# EAGLE design PM_Controller_v1p05 (EAGLE 9.6.2)
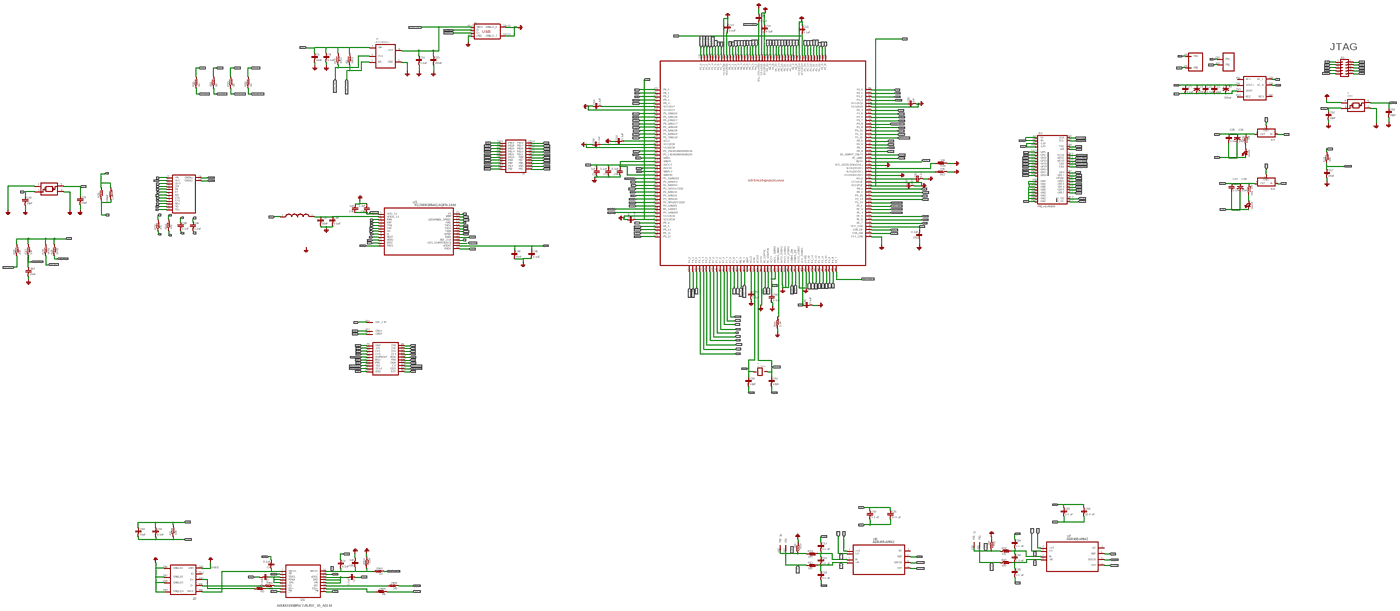
[diagram p0: schematic, sheet 1, overview]
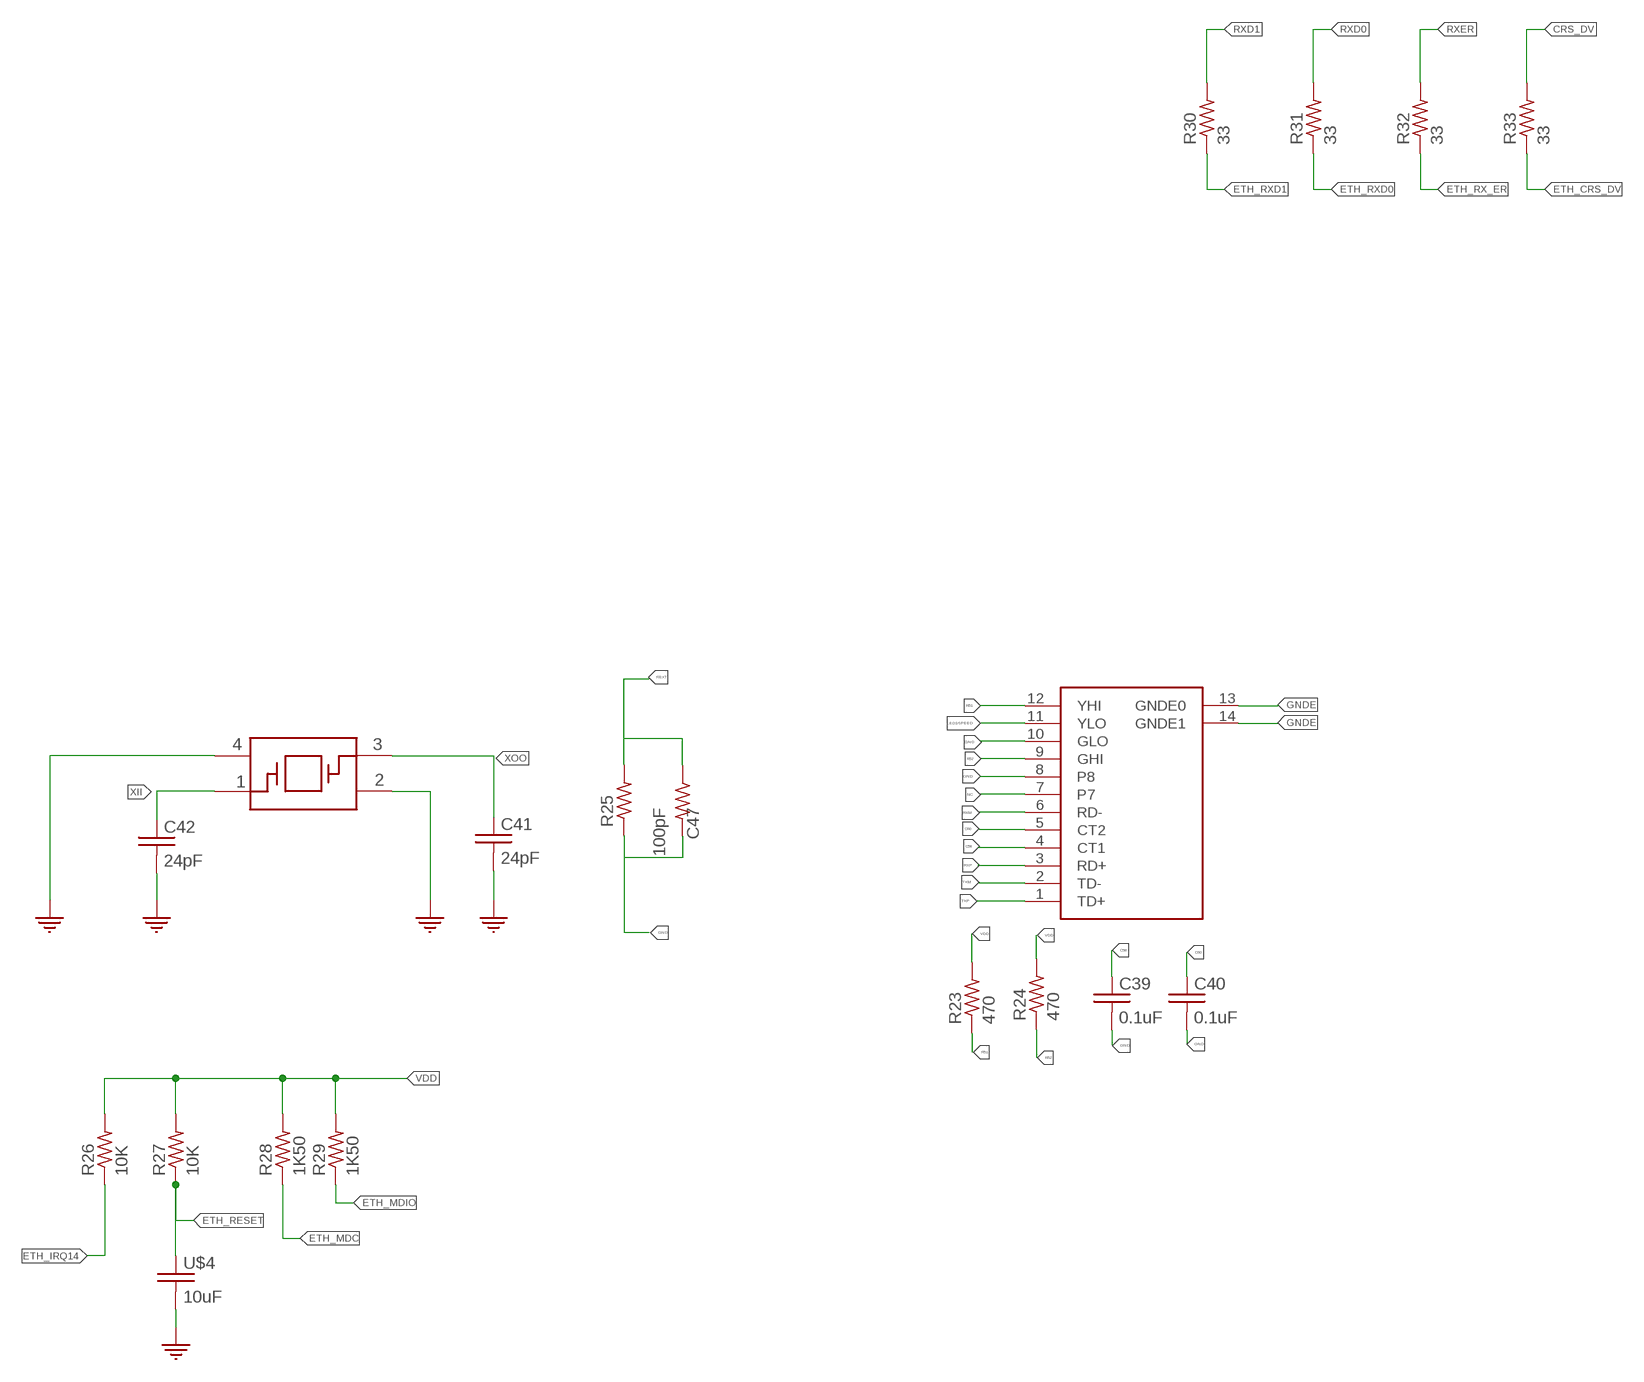
[diagram p1: schematic, sheet 1, part 1 of 7]
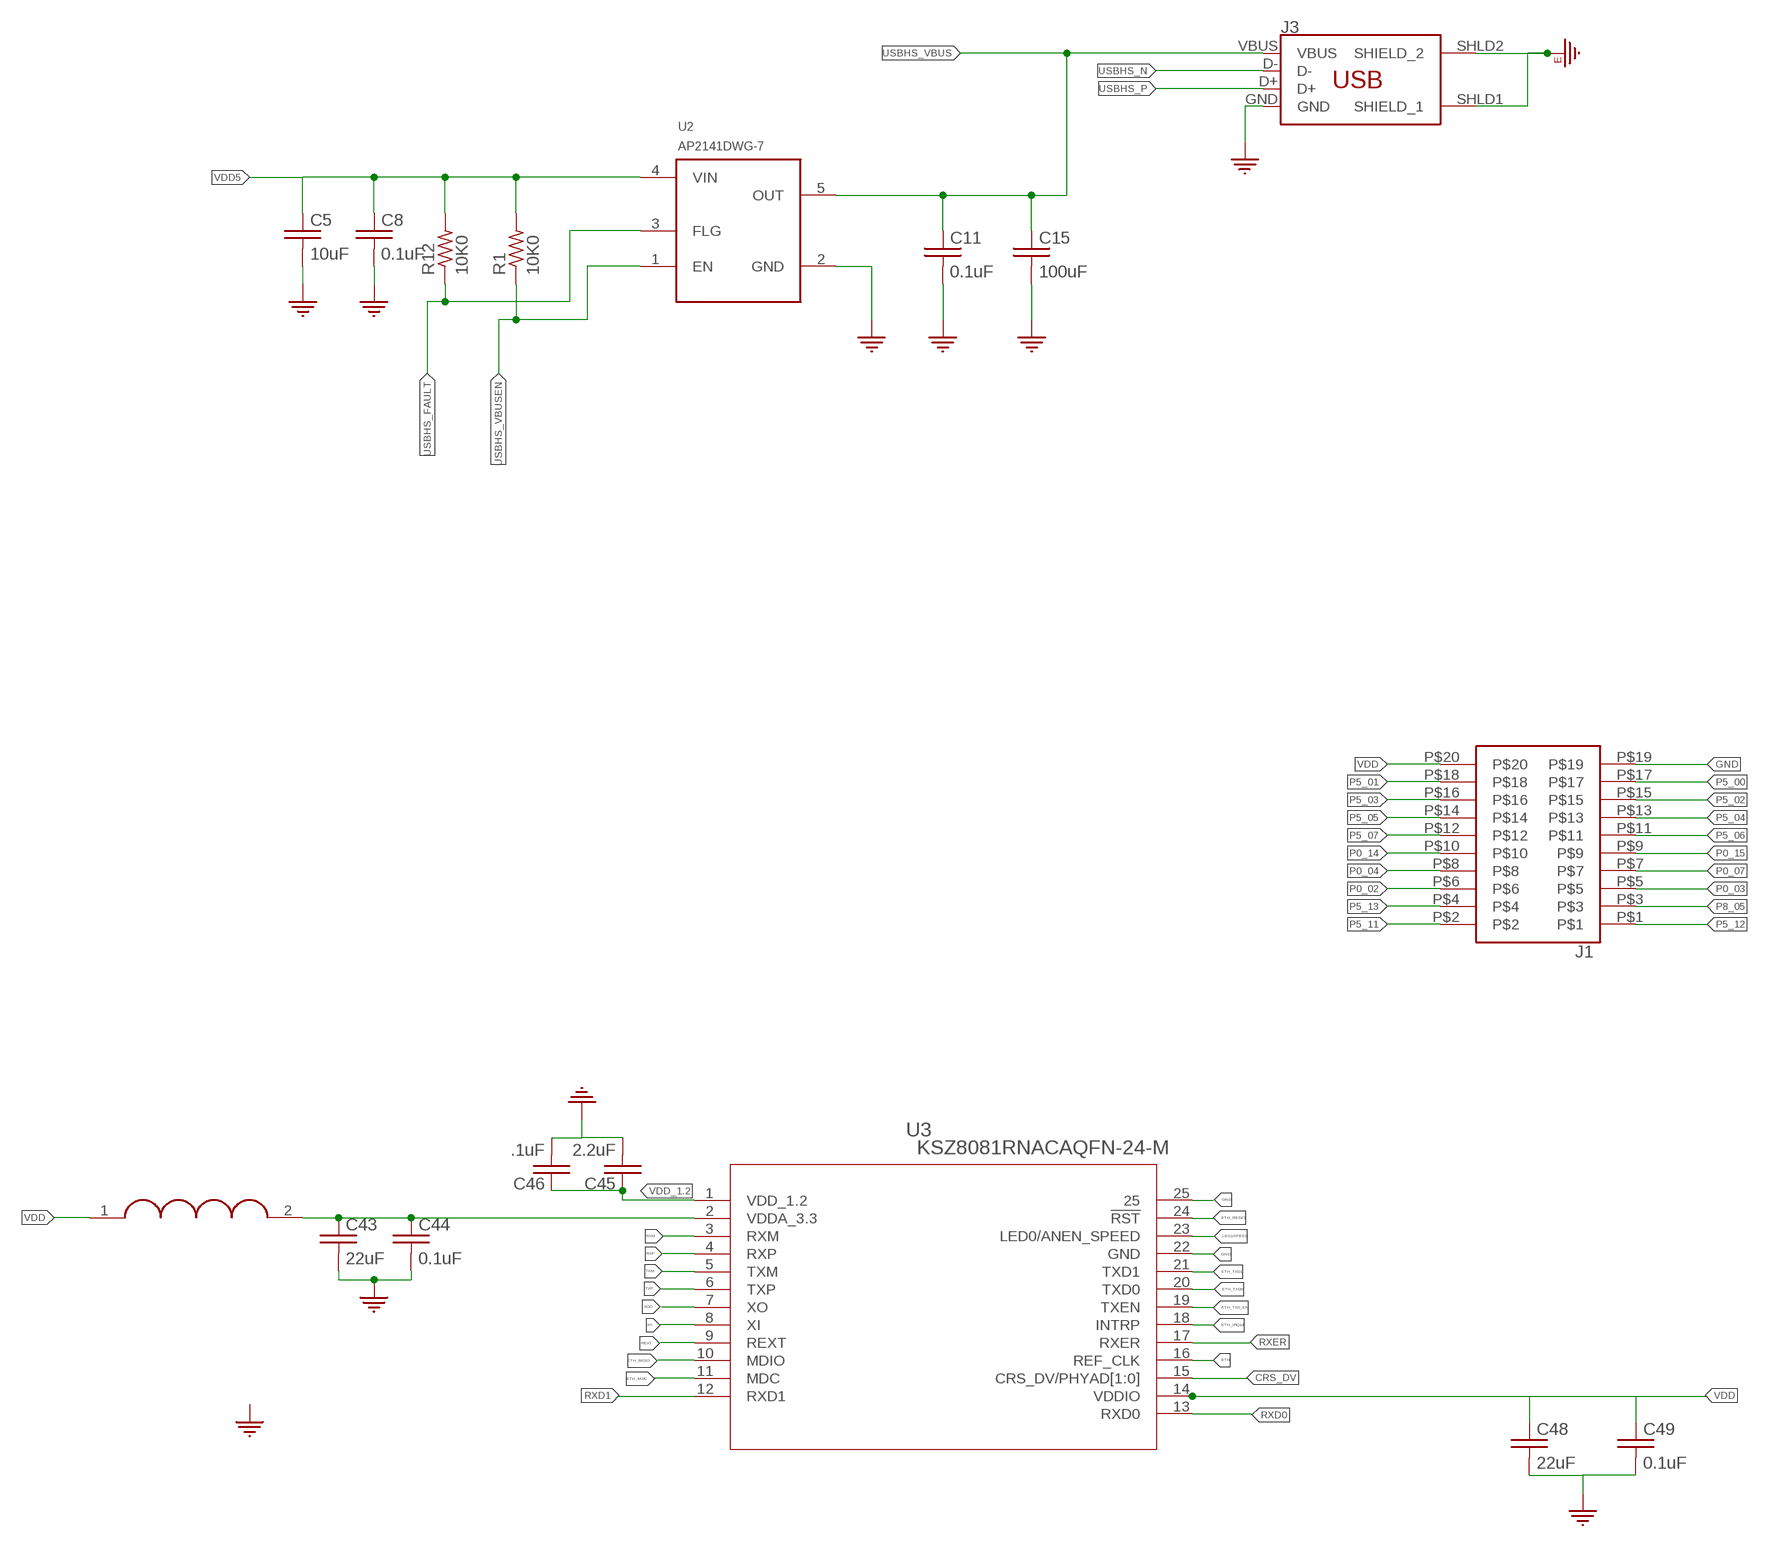
[diagram p2: schematic, sheet 1, part 2 of 7]
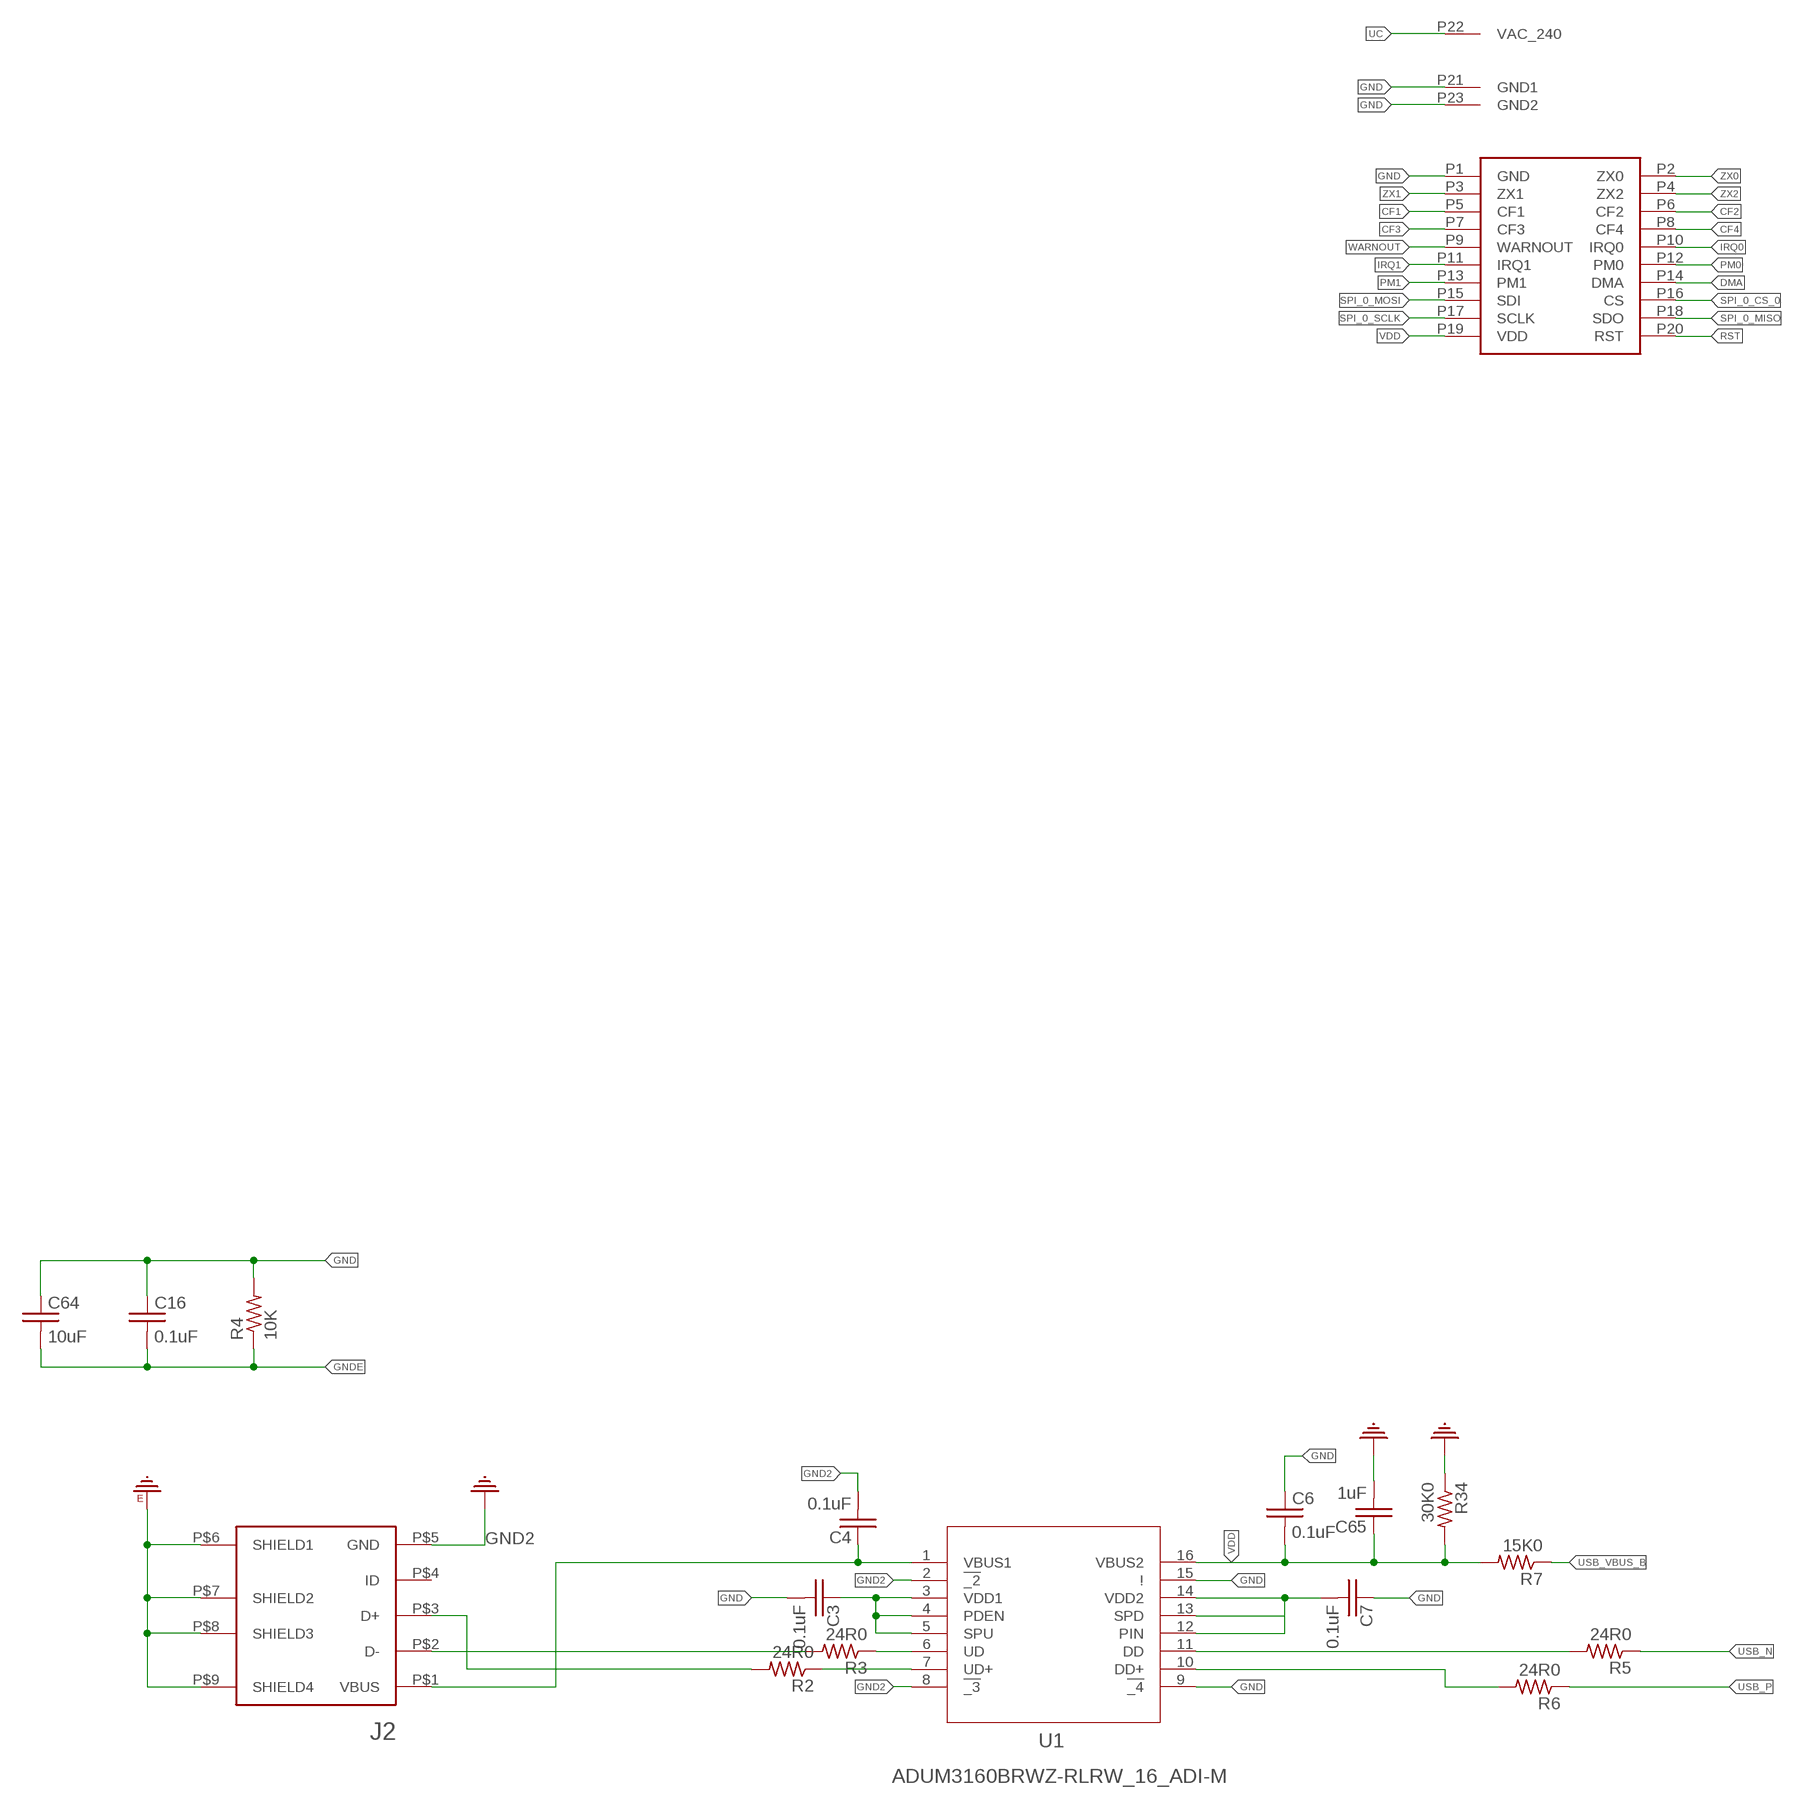
[diagram p3: schematic, sheet 1, part 3 of 7]
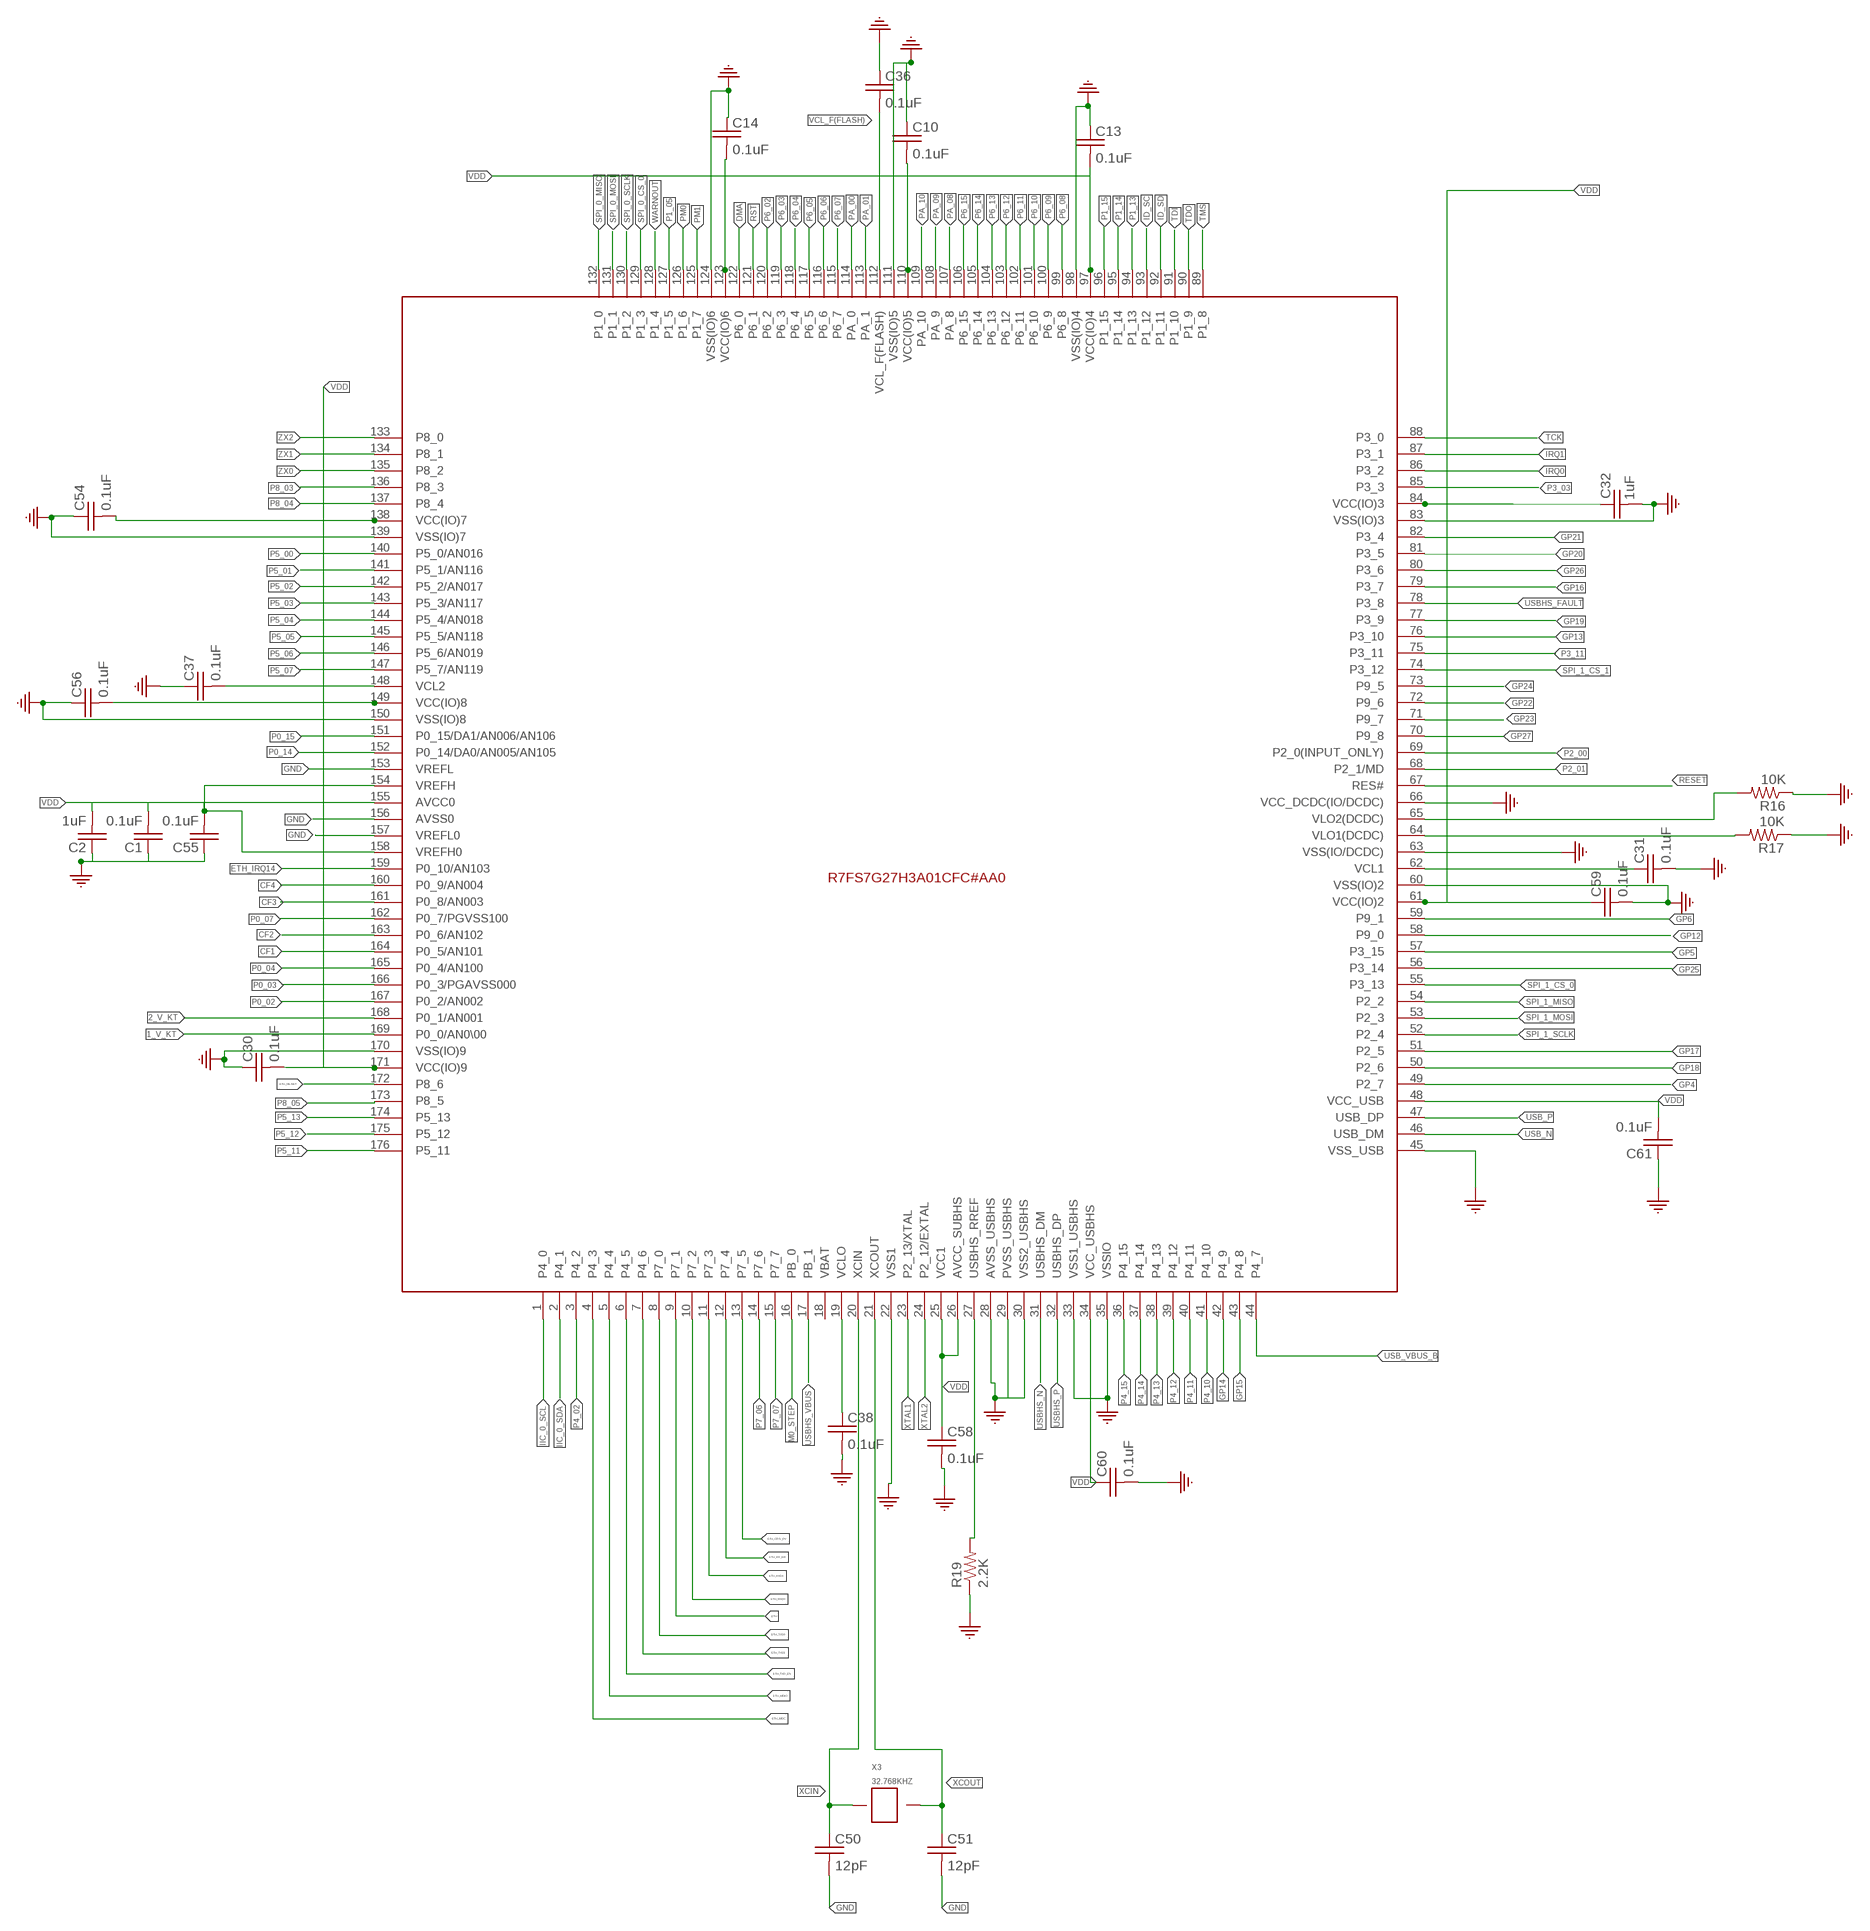
[diagram p4: schematic, sheet 1, part 4 of 7]
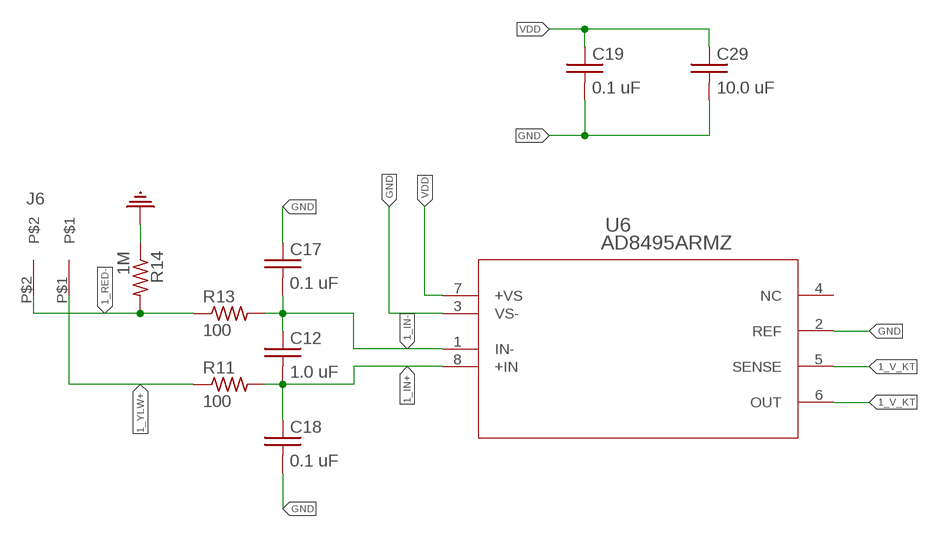
[diagram p5: schematic, sheet 1, part 5 of 7]
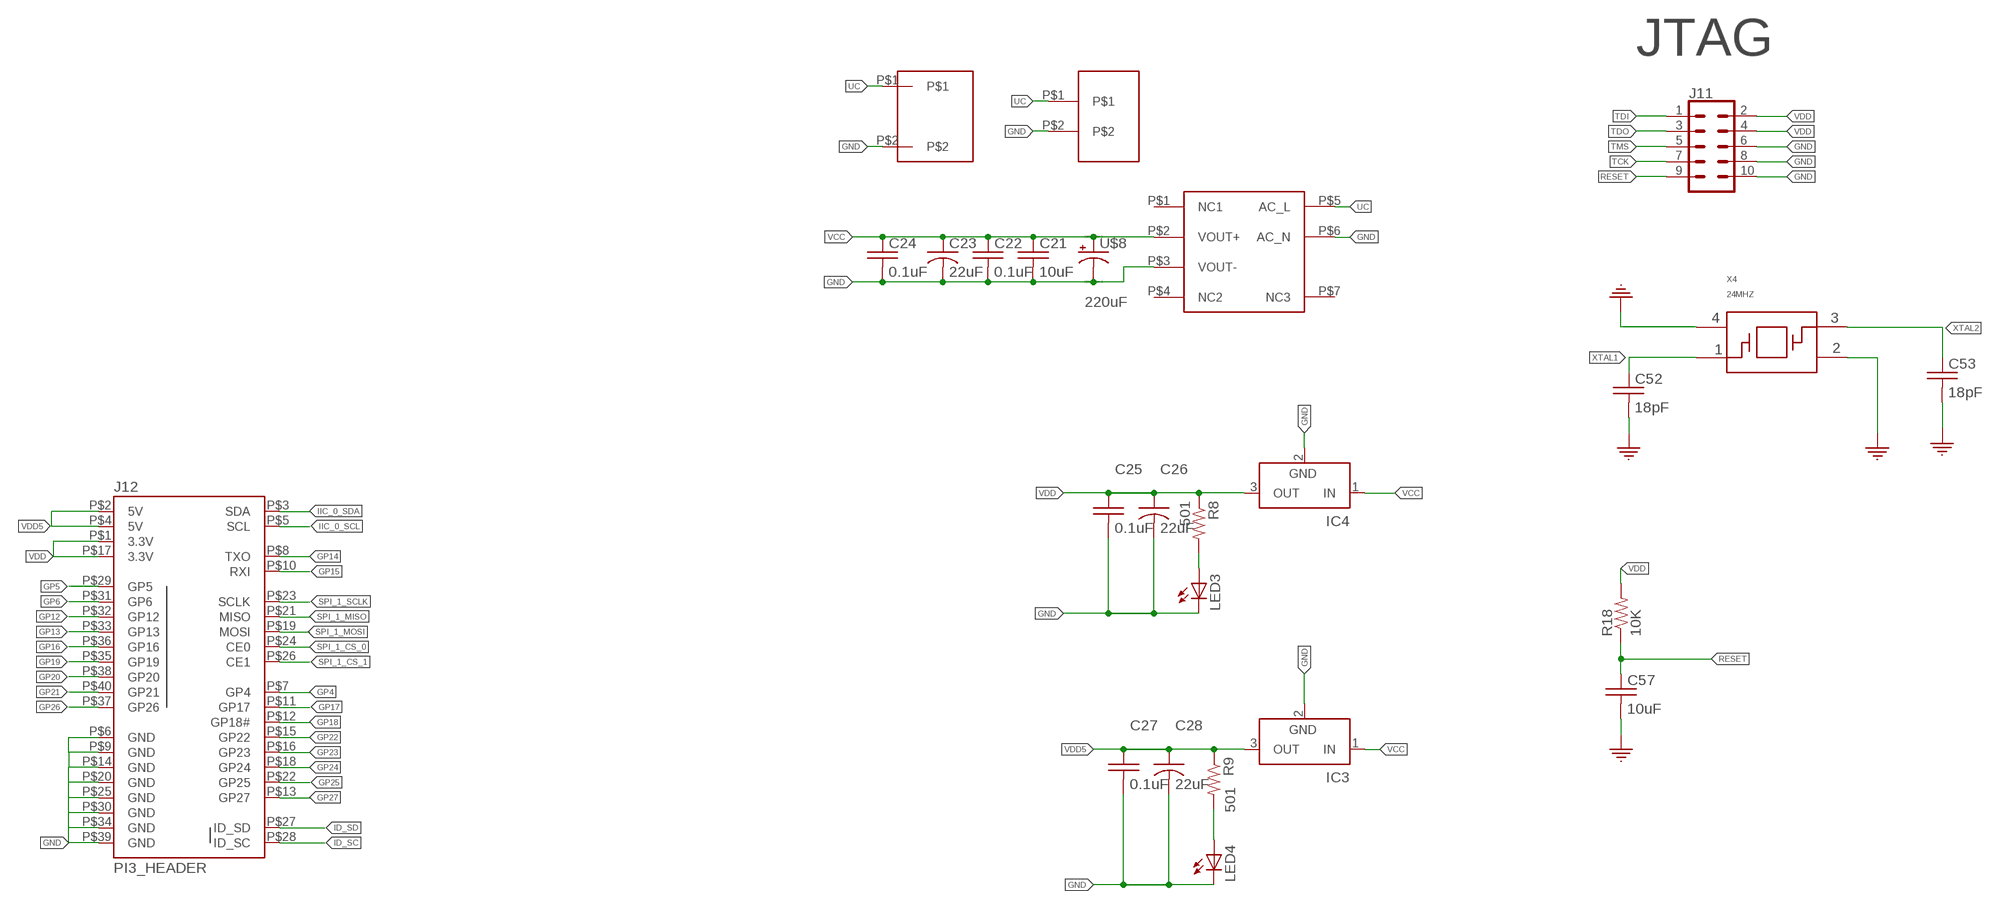
[diagram p6: schematic, sheet 1, part 6 of 7]
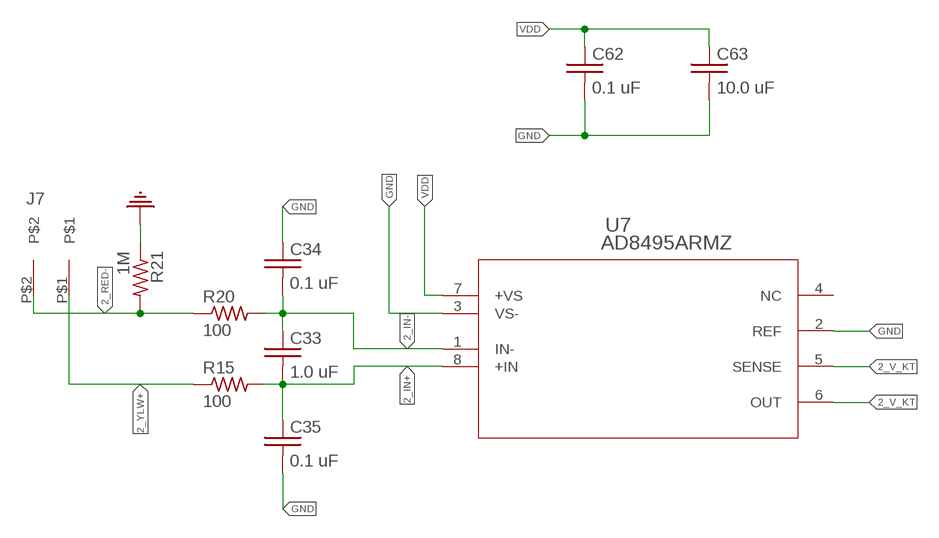
[diagram p7: schematic, sheet 1, part 7 of 7]

## Parts
C1  0.1uF  C_0402  [0402]
C2  1uF  C_0402  [0402]
C3  0.1uF  C_0402  [0402]
C4  0.1uF  C_0402  [0402]
C5  10uF  C_0402  [0402]
C6  0.1uF  C_0402  [0402]
C7  0.1uF  C_0402  [0402]
C8  0.1uF  C_0402  [0402]
C10  0.1uF  C_0402  [0402]
C11  0.1uF  C_0402  [0402]
C12  1.0 uF  C_0402  [0402]
C13  0.1uF  C_0402  [0402]
C14  0.1uF  C_0402  [0402]
C15  100uF  C_1210  [C1210]
C16  0.1uF  C_0402  [0402]
C17  0.1 uF  C_0402  [0402]
C18  0.1 uF  C_0402  [0402]
C19  0.1 uF  C_0402  [0402]
C20  CAP_THIN_FILM_TDK_32922CAP  [CAP_THIN_FILM_32922]
C21  10uF  C_0402  [0402]
C22  0.1uF  C_0402  [0402]
C23  22uF  C-USC1206  [C1206]
C24  0.1uF  C_0402  [0402]
C25  0.1uF  C_0402  [0402]
C26  22uF  C-USC1206  [C1206]
C27  0.1uF  C_0402  [0402]
C28  22uF  C-USC1206  [C1206]
C29  10.0 uF  C_0402  [0402]
C30  0.1uF  C_0402  [0402]
C31  0.1uF  C_0402  [0402]
C32  1uF  C_0402  [0402]
C33  1.0 uF  C_0402  [0402]
C34  0.1 uF  C_0402  [0402]
C35  0.1 uF  C_0402  [0402]
C36  0.1uF  C_0402  [0402]
C37  0.1uF  C_0402  [0402]
C38  0.1uF  C_0402  [0402]
C39  0.1uF  C_0402  [0402]
C40  0.1uF  C_0402  [0402]
C41  24pF  C_0402  [0402]
C42  24pF  C_0402  [0402]
C43  22uF  C_0603  [0603]
C44  0.1uF  C_0402  [0402]
C45  2.2uF  C_0402  [0402]
C46  .1uF  C_0402  [0402]
C47  100pF  R_0402  [0402]
C48  22uF  C_0603  [0603]
C49  0.1uF  C_0402  [0402]
C50  12pF  C_0402  [0402]
C51  12pF  C_0402  [0402]
C52  18pF  C_0402  [0402]
C53  18pF  C_0402  [0402]
C54  0.1uF  C_0402  [0402]
C55  0.1uF  C_0402  [0402]
C56  0.1uF  C_0402  [0402]
C57  10uF  C_0402  [0402]
C58  0.1uF  C_0402  [0402]
C59  0.1uF  C_0402  [0402]
C60  0.1uF  C_0402  [0402]
C61  0.1uF  C_0402  [0402]
C62  0.1 uF  C_0402  [0402]
C63  10.0 uF  C_0402  [0402]
C64  10uF  C_0402  [0402]
C65  1uF  C_0402  [0402]
FB2/2  FB_0805_120_OHM  [0805]
IC3  LT1129CST5  [SOT223]
IC4  LT1129CST3  [SOT223]
J1  2_X_10_HEADER_GENERIC  [2_X_10_.1_INCH]
J2  USB_MICRO-B  [USB_MICRO-B]
J3  USB_A  [USB_A_SMT]
J4  RJ45_WITH_ELEC  [RJ45_TH_ELEC]
J6  3.81MM_1_X_2_RT_ANGLE_PLUG_HEADER  [2_3.81MM_PITCH]
J7  3.81MM_1_X_2_RT_ANGLE_PLUG_HEADER  [2_3.81MM_PITCH]
J11  CONN_05X2PTH  [2X5]
J12  PI3_HEADER  [HEADER_2_X_20_.1_INCH]
LED3  LED_0805_GREEN  [LED_0805_GREEN]
LED4  LED_0805_GREEN  [LED_0805_GREEN]
R1  10K0  R_0402  [0402]
R2  24R0  R_0402  [0402]
R3  24R0  R_0402  [0402]
R4  10K  R_0402  [0402]
R5  24R0  R_0402  [0402]
R6  24R0  R_0402  [0402]
R7  15K0  R_0402  [0402]
R8  501  R_0402  [0402]
R9  501  R_0402  [0402]
R11  100  R_0402  [0402]
R12  10K0  R_0402  [0402]
R13  100  R_0402  [0402]
R14  1M  R_0402  [0402]
R15  100  R_0402  [0402]
R16  10K  R_0402  [0402]
R17  10K  R_0402  [0402]
R18  10K  R_0402  [0402]
R19  2.2K  R_0402  [0402]
R20  100  R_0402  [0402]
R21  1M  R_0402  [0402]
R23  470  R_0402  [0402]
R24  470  R_0402  [0402]
R25  6k49  R_0402  [0402]
R26  10K  R_0402  [0402]
R27  10K  R_0402  [0402]
R28  1K50  R_0402  [0402]
R29  1K50  R_0402  [0402]
R30  33  R_0402  [0402]
R31  33  R_0402  [0402]
R32  33  R_0402  [0402]
R33  33  R_0402  [0402]
R34  30K0  R_0402  [0402]
U1  ADUM3160BRWZ-RLRW_16_ADI-M  [RW_16_ADI-M]
U2  AP2141DWG-5  [SOT-23-5]
U3  KSZ8081RNACAQFN-24-M  [QFN-24-M]
U4  S7G2_X_176  [LQFP176_24X24]
U5  TMLM_04109  [TMLM04]
U6  AD8495ARMZ  [RM_8_ADI]
U7  AD8495ARMZ  [RM_8_ADI]
U$2  METER_BASE  [METER_BASE]
U$3  XTAL_25_MHZ  [SMD_3225]
U$4  10uF  C_0402  [0402]
U$7  VAR_10MM_VDRUS10  [VAR_10MM_VDRUS10]
U$8  220uF  C_AL_ELECTROLYTIC_SMD_220UF  [C_AL_ELECTROLYTIC_SMD_220UF]
X3  32.768KHZ  XTAL_32.768KHZ  [SMD_X_2_PADS]
X4  24MHZ  XTAL_24_MHZ  [SMD_3225]

## Nets
1_IN+: C12.P$2 C18.P$1 R11.P$2 U6.8(+IN)
1_IN-: C12.P$1 C17.P$2 R13.P$2 U6.1(IN-)
1_RED-: J6.P$2 R13.P$1 R14.P$2
1_V_KT: U4.169(P0_0/AN0\00) U6.5(SENSE) U6.6(OUT)
1_YLW+: J6.P$1 R11.P$1
2_IN+: C33.P$2 C35.P$1 R15.P$2 U7.8(+IN)
2_IN-: C33.P$1 C34.P$2 R20.P$2 U7.1(IN-)
2_RED-: J7.P$2 R20.P$1 R21.P$2
2_V_KT: U4.168(P0_1/AN001) U7.5(SENSE) U7.6(OUT)
2_YLW+: J7.P$1 R15.P$1
C58: C39.P$1 J4.4(CT1)
C60: C40.P$1 J4.5(CT2)
CF1: U4.164(P0_5/AN101) U$2.P5(CF1)
CF2: U4.163(P0_6/AN102) U$2.P6(CF2)
CF3: U4.161(P0_8/AN003) U$2.P7(CF3)
CF4: U4.160(P0_9/AN004) U$2.P8(CF4)
CRS_DV: R33.P$2 U3.15(CRS_DV/PHYAD[1:0])
D-: R5.P$2 U1.11(DD)
DMA: U4.122(P6_0) U$2.P14(DMA)
ETH: U3.16(REF_CLK) U4.9(P7_1)
ETH_CRS_DV: R33.P$1 U4.13(P7_5)
ETH_IRQ14: R26.P$1 U3.18(INTRP) U4.159(P0_10/AN103)
ETH_MDC: R28.P$1 U3.11(MDC) U4.4(P4_3)
ETH_MDIO: R29.P$1 U3.10(MDIO) U4.5(P4_4)
ETH_RESET: R27.P$1 U3.24(!RST) U4.172(P8_6) U$4.P$1
ETH_RX_ER: R32.P$1 U4.12(P7_4)
ETH_RXD0: R31.P$1 U4.10(P7_2)
ETH_RXD1: R30.P$1 U4.11(P7_3)
ETH_TXD0: U3.20(TXD0) U4.8(P7_0)
ETH_TXD1: U3.21(TXD1) U4.7(P4_6)
ETH_TXD_EN: U3.19(TXEN) U4.6(P4_5)
GND: C1.P$1 C2.P$1 C3.P$2 C5.P$2 C6.P$1 C7.P$1 C8.P$2 C10.P$1 C11.P$2 C13.P$1 C14.P$1 C15.2 C16.P$1 C17.P$1 C18.P$2 C19.P$2 C20.P$2 C21.P$2 C22.P$2 C23.2 C24.P$2 C25.P$2 C26.2 C27.P$2 C28.2 C29.P$2 C30.P$1 C31.P$2 C32.P$2 C34.P$1 C35.P$2 C36.P$1 C37.P$1 C38.P$2 C39.P$2 C40.P$2 C41.P$2 C42.P$2 C43.2 C44.P$2 C45.P$2 C46.P$2 C47.P$2 C48.2 C49.P$2 C50.P$2 C51.P$2 C52.P$2 C53.P$2 C54.P$1 C55.P$1 C56.P$1 C57.P$2 C58.P$2 C59.P$2 C60.P$2 C61.P$1 C62.P$2 C63.P$2 C64.P$1 C65.P$2 IC3.2(GND) IC4.2(GND) J1.P$19 J3.GND J4.8 J4.10(GLO) J11.6 J11.8 J11.10 J12.P$6(GND) J12.P$9(GND) J12.P$14(GND) J12.P$20(GND) J12.P$25(GND) J12.P$30(GND) J12.P$34(GND) J12.P$39(GND) LED3.C LED4.C R4.P$2 R14.P$1 R16.P$1 R17.P$1 R19.P$1 R21.P$1 R25.P$1 R34.P$1 U1.9(!_4) U1.15(!) U2.2(GND) U3.22(GND) U3.25 U4.22(VSS1) U4.28(AVSS_USBHS) U4.29(PVSS_USBHS) U4.30(VSS2_USBHS) U4.33(VSS1_USBHS) U4.35(VSSIO) U4.45(VSS_USB) U4.60(VSS(IO)2) U4.63(VSS(IO/DCDC)) U4.66(VCC_DCDC(IO/DCDC)) U4.83(VSS(IO)3) U4.98(VSS(IO)4) U4.111(VSS(IO)5) U4.124(VSS(IO)6) U4.139(VSS(IO)7) U4.150(VSS(IO)8) U4.153(VREFL) U4.156(AVSS0) U4.157(VREFL0) U4.170(VSS(IO)9) U5.P$3(VOUT-) U5.P$6(AC_N) U6.2(REF) U6.3(VS-) U7.2(REF) U7.3(VS-) U$2.P1(GND) U$2.P21(GND1) U$2.P23(GND2) U$3.2 U$3.4 U$4.P$2 U$7.P$2 U$8.N-(-) X4.2 X4.4
GND2: C4.P$2 J2.P$5(GND) U1.2(!_2) U1.8(!_3) ; supply symbol labelled GND
GNDE: C16.P$2 C64.P$2 J2.P$6(SHIELD1) J2.P$7(SHIELD2) J2.P$8(SHIELD3) J2.P$9(SHIELD4) J3.SHLD1(SHIELD_1) J3.SHLD2(SHIELD_2) J4.13(GNDE0) J4.14(GNDE1) R4.P$1
GP4: J12.P$7(GP4) U4.49(P2_7)
GP5: J12.P$29(GP5) U4.57(P3_15)
GP6: J12.P$31(GP6) U4.59(P9_1)
GP12: J12.P$32(GP12) U4.58(P9_0)
GP13: J12.P$33(GP13) U4.76(P3_10)
GP14: J12.P$8(TXO) U4.42(P4_9)
GP15: J12.P$10(RXI) U4.43(P4_8)
GP16: J12.P$36(GP16) U4.79(P3_7)
GP17: J12.P$11(GP17) U4.51(P2_5)
GP18: J12.P$12(GP18#) U4.50(P2_6)
GP19: J12.P$35(GP19) U4.77(P3_9)
GP20: J12.P$38(GP20) U4.81(P3_5)
GP21: J12.P$40(GP21) U4.82(P3_4)
GP22: J12.P$15(GP22) U4.72(P9_6)
GP23: J12.P$16(GP23) U4.71(P9_7)
GP24: J12.P$18(GP24) U4.73(P9_5)
GP25: J12.P$22(GP25) U4.56(P3_14)
GP26: J12.P$37(GP26) U4.80(P3_6)
GP27: J12.P$13(GP27) U4.70(P9_8)
ID_SC: J12.P$28(ID_SC) U4.93(P1_12)
ID_SD: J12.P$27(ID_SD) U4.92(P1_11)
IIC_0_SCL: J12.P$5(SCL) U4.1(P4_0)
IIC_0_SDA: J12.P$3(SDA) U4.2(P4_1)
IRQ0: U4.86(P3_2) U$2.P10(IRQ0)
IRQ1: U4.87(P3_1) U$2.P11(IRQ1)
LED1/SPEED: J4.11(YLO) U3.23(LED0/ANEN_SPEED)
M0_STEP: U4.16(PB_0)
N$1: C37.P$2 U4.148(VCL2)
N$2: J2.P$2(D-) R3.P$2
N$3: R2.P$1 U1.7(UD+)
N$4: C38.P$1 U4.19(VCLO)
N$5: C31.P$1 U4.62(VCL1)
N$6: R17.P$2 U4.64(VLO1(DCDC))
N$7: R16.P$2 U4.65(VLO2(DCDC))
N$8: R19.P$2 U4.27(USBHS_RREF)
N$9: LED3.A R8.P$2
N$10: LED4.A R9.P$2
N$11: C4.P$1 J2.P$1(VBUS) U1.1(VBUS1)
N$12: R3.P$1 U1.6(UD)
N$13: J2.P$3(D+) R2.P$2
N$14: C3.P$1 U1.3(VDD1) U1.4(PDEN) U1.5(SPU)
N$15: C7.P$2 U1.12(PIN) U1.13(SPD) U1.14(VDD2)
N$16: R6.P$2 U1.10(DD+)
NC: J4.7
P0_02: J1.P$6 U4.167(P0_2/AN002)
P0_03: J1.P$5 U4.166(P0_3/PGAVSS000)
P0_04: J1.P$8 U4.165(P0_4/AN100)
P0_07: J1.P$7 U4.162(P0_7/PGVSS100)
P0_14: J1.P$10 U4.152(P0_14/DA0/AN005/AN105)
P0_15: J1.P$9 U4.151(P0_15/DA1/AN006/AN106)
P1_05: U4.127(P1_5)
P1_13: U4.94(P1_13)
P1_14: U4.95(P1_14)
P1_15: U4.96(P1_15)
P2_00: U4.69(P2_0(INPUT_ONLY))
P2_01: U4.68(P2_1/MD)
P3_03: U4.85(P3_3)
P3_11: U4.75(P3_11)
P4_02: U4.3(P4_2)
P4_10: U4.41(P4_10)
P4_11: U4.40(P4_11)
P4_12: U4.39(P4_12)
P4_13: U4.38(P4_13)
P4_14: U4.37(P4_14)
P4_15: U4.36(P4_15)
P5_00: J1.P$17 U4.140(P5_0/AN016)
P5_01: J1.P$18 U4.141(P5_1/AN116)
P5_02: J1.P$15 U4.142(P5_2/AN017)
P5_03: J1.P$16 U4.143(P5_3/AN117)
P5_04: J1.P$13 U4.144(P5_4/AN018)
P5_05: J1.P$14 U4.145(P5_5/AN118)
P5_06: J1.P$11 U4.146(P5_6/AN019)
P5_07: J1.P$12 U4.147(P5_7/AN119)
P5_11: J1.P$2 U4.176(P5_11)
P5_12: J1.P$1 U4.175(P5_12)
P5_13: J1.P$4 U4.174(P5_13)
P6_02: U4.120(P6_2)
P6_03: U4.119(P6_3)
P6_04: U4.118(P6_4)
P6_05: U4.117(P6_5)
P6_06: U4.116(P6_6)
P6_07: U4.115(P6_7)
P6_08: U4.99(P6_8)
P6_09: U4.100(P6_9)
P6_10: U4.101(P6_10)
P6_11: U4.102(P6_11)
P6_12: U4.103(P6_12)
P6_13: U4.104(P6_13)
P6_14: U4.105(P6_14)
P6_15: U4.106(P6_15)
P7_06: U4.14(P7_6)
P7_07: U4.15(P7_7)
P8_03: U4.136(P8_3)
P8_04: U4.137(P8_4)
P8_05: J1.P$3 U4.173(P8_5)
PA_00: U4.114(PA_0)
PA_01: U4.113(PA_1)
PA_08: U4.107(PA_8)
PA_09: U4.108(PA_9)
PA_10: U4.109(PA_10)
PM0: U4.126(P1_6) U$2.P12(PM0)
PM1: U4.125(P1_7) U$2.P13(PM1)
R51: J4.12(YHI) R23.P$1
R52: J4.9(GHI) R24.P$1
RESET: C57.P$1 J11.9 R18.P$1 U4.67(RES#)
REXT: C47.P$1 R25.P$2 U3.9(REXT)
RST: U4.121(P6_1) U$2.P20(RST)
RXD0: R31.P$2 U3.13(RXD0)
RXD1: R30.P$2 U3.12(RXD1)
RXER: R32.P$2 U3.17(RXER)
RXM: J4.6(RD-) U3.3(RXM)
RXP: J4.3(RD+) U3.4(RXP)
SPI_0_CS_0: U4.129(P1_3) U$2.P16(CS)
SPI_0_MISO: U4.132(P1_0) U$2.P18(SDO)
SPI_0_MOSI: U4.131(P1_1) U$2.P15(SDI)
SPI_0_SCLK: U4.130(P1_2) U$2.P17(SCLK)
SPI_1_CS_0: J12.P$24(CE0) U4.55(P3_13)
SPI_1_CS_1: J12.P$26(CE1) U4.74(P3_12)
SPI_1_MISO: J12.P$21(MISO) U4.54(P2_2)
SPI_1_MOSI: J12.P$19(MOSI) U4.53(P2_3)
SPI_1_SCLK: J12.P$23(SCLK) U4.52(P2_4)
TCK: J11.7 U4.88(P3_0)
TDI: J11.1 U4.91(P1_10)
TDO: J11.3 U4.90(P1_9)
TMS: J11.5 U4.89(P1_8)
TXM: J4.2(TD-) U3.5(TXM)
TXP: J4.1(TD+) U3.6(TXP)
UC: C20.P$1 U5.P$5(AC_L) U$2.P22(VAC_240) U$7.P$1
USB_N: R5.P$1 U4.46(USB_DM)
USB_P: R6.P$1 U4.47(USB_DP)
USB_VBUS_B: R7.P$1 U4.44(P4_7)
USBHS_FAULT: R12.P$1 U2.3(FLG) U4.78(P3_8)
USBHS_N: J3.D- U4.31(USBHS_DM)
USBHS_P: J3.D+ U4.32(USBHS_DP)
USBHS_VBUS: C11.P$1 C15.1 J3.VBUS U2.5(OUT) U4.17(PB_1)
USBHS_VBUSEN: R1.P$1 U2.1(EN)
VCC: C21.P$1 C22.P$1 C23.1 C24.P$1 IC3.1(IN) IC4.1(IN) U5.P$2(VOUT+) U$8.P+(+)
VCL_F(FLASH): C36.P$2 U4.112(VCL_F(FLASH))
VDD: C1.P$2 C2.P$2 C6.P$2 C10.P$2 C13.P$2 C14.P$2 C19.P$1 C25.P$1 C26.1 C29.P$1 C30.P$2 C32.P$1 C48.1 C49.P$1 C54.P$2 C55.P$2 C56.P$2 C58.P$1 C59.P$1 C60.P$1 C61.P$2 C62.P$1 C63.P$1 C65.P$1 FB2/2.1 IC4.3(OUT) J1.P$20 J11.2 J11.4 J12.P$1(3.3V) J12.P$17(3.3V) R7.P$2 R8.P$1 R18.P$2 R23.P$2 R24.P$2 R26.P$2 R27.P$2 R28.P$2 R29.P$2 R34.P$2 U1.16(VBUS2) U3.14(VDDIO) U4.25(VCC1) U4.26(AVCC_SUBHS) U4.34(VCC_USBHS) U4.48(VCC_USB) U4.61(VCC(IO)2) U4.84(VCC(IO)3) U4.97(VCC(IO)4) U4.110(VCC(IO)5) U4.123(VCC(IO)6) U4.138(VCC(IO)7) U4.149(VCC(IO)8) U4.154(VREFH) U4.155(AVCC0) U4.158(VREFH0) U4.171(VCC(IO)9) U6.7(+VS) U7.7(+VS) U$2.P19(VDD)
VDD5: C5.P$1 C8.P$1 C27.P$1 C28.1 IC3.3(OUT) J12.P$2(5V) J12.P$4(5V) R1.P$2 R9.P$1 R12.P$2 U2.4(VIN)
VDD_1.2: C45.P$1 C46.P$1 U3.1(VDD_1.2)
VDD_ENET1: C43.1 C44.P$1 FB2/2.2 U3.2(VDDA_3.3)
WARNOUT: U4.128(P1_4) U$2.P9(WARNOUT)
XCIN: C50.P$1 U4.20(XCIN) X3.P$1
XCOUT: C51.P$1 U4.21(XCOUT) X3.P$2
XII: C42.P$1 U3.8(XI) U$3.1
XOO: C41.P$1 U3.7(XO) U$3.3
XTAL1: C52.P$1 U4.23(P2_13/XTAL) X4.1
XTAL2: C53.P$1 U4.24(P2_12/EXTAL) X4.3
ZX0: U4.135(P8_2) U$2.P2(ZX0)
ZX1: U4.134(P8_1) U$2.P3(ZX1)
ZX2: U4.133(P8_0) U$2.P4(ZX2)
Unconnected: J2.P$4(ID) U4.18(VBAT) U5.P$1(NC1) U5.P$4(NC2) U5.P$7(NC3) U6.4(NC) U7.4(NC)

## Notes on the sheet
- JTAG

## Power pins joined to a net without a drawn wire
GND: IC3.4(GND) IC4.4(GND)

## Library data of the parts
C1-C8 C10-C14 C16-C19 C21 C22 C24 C25 C27 C29-C42 C44-C46 C49-C65 U$4 = 3D_MIG_Controller:C_0402
C15 = 3D_MIG_Controller:C_1210
C20 = 3D_MIG_Controller:CAP_THIN_FILM_TDK_32922
C23 C26 C28 = 3D_MIG_Controller:C-US: CAPACITOR, American symbol
C43 C48 = 3D_MIG_Controller:C_0603
C47 R1-R9 R11-R21 R23-R34 = 3D_MIG_Controller:R_0402
FB2/2 = 3D_MIG_Controller:FB_0805_120_OHM
IC3 = 3D_MIG_Controller:LT1129CST5: VOLTAGE REGULATOR with shutdown; MPN: LT1129CST-5#PBF; OC_FARNELL: 1663375; OC_NEWARK: 57M2069
IC4 = 3D_MIG_Controller:LT1129CST3: VOLTAGE REGULATOR with shutdown; MPN: LT1129CST-5#PBF; OC_FARNELL: 1663375; OC_NEWARK: 57M2069
J1 = 3D_MIG_Controller:2_X_10_HEADER_GENERIC
J2 = 3D_MIG_Controller:USB_MICRO-B
J3 = 3D_MIG_Controller:USB_A: USB-A Connector Male and female variants, as well as PTH and SMT variants SparkFun Products: SparkFun XBee Explorer Dongle <https://www.sparkfun.com/products/11697> PTH Male SparkFun MicroView-USB Programmer <https://www.sparkfun.com/products/12924> SMT Male SparkFun USB Type A Female Breakout <https://www.sparkfun.com/products/12700> SMT Female
J4 = 3D_MIG_Controller:RJ45_WITH_ELEC
J6 J7 = 3D_MIG_Controller:3.81MM_1_X_2_RT_ANGLE_PLUG_HEADER
J11 = 3D_MIG_Controller:CONN_05X2: Multi connection point. Often used as Generic Header-pin footprint for 0.1 inch spaced/style header connections For AVR SPI programming port, see special device with nice symbol: "AVR_SPI_PROG_5x2.dev" You can populate with any combo of single row headers, but if you'd like an exact match, check these: 2x5 AVR ICSP Male Header <https://www.sparkfun.com/products/778> (PRT-00778) 2x5 Pin Shrouded Header <https://www.sparkfun.com/products/8506> (PRT-08506) On any of the 0.1 inch spaced packages, you can populate with these: Break Away Headers - Straight <https://www.sparkfun.com/products/116> (PRT-00116) Break Away Male Headers - Right Angle <https://www.sparkfun.com/products/553> (PRT-00553) Female Headers <https://www.sparkfun.com/products/115> (PRT-00115) Break Away Headers - Machine Pin <https://www.sparkfun.com/products/117> (PRT-00117) Break Away Female Headers - Swiss Machine Pin <https://www.sparkfun.com/products/743> (PRT-00743) Special note: the shrouded connector mates well with our 5x2 ribbon cables: 2x5 Pin IDC Ribbon Cable <https://www.sparkfun.com/products/8535> (PRT-08535); PROD_ID: CONN-08499; SF_ID: PRT-0778
J12 = 3D_MIG_Controller:PI3_HEADER
LED3 LED4 = 3D_MIG_Controller:LED_0805_GREEN
U1 = 3D_MIG_Controller:ADUM3160BRWZ-RL; BUILT_BY: EMA_UL_Team; COPYRIGHT: Copyright (C) 2018 Accelerated Designs. All rights reserved; MANUFACTURER_PART_NUMBER: ADUM3160BRWZ-RL; SOURCELIBRARY: Analog_2019-03-08; VENDOR: Analog Devices Inc
U2 = 3D_MIG_Controller:AP2141DWG-5
U3 = 3D_MIG_Controller:KSZ8081RNACA; MANUFACTURER_PART_NUMBER: KSZ8081RNACA; VENDOR: Micrel
U4 = 3D_MIG_Controller:S7G2_X_176
U5 = 3D_MIG_Controller:TMLM_04109
U6 U7 = 3D_MIG_Controller:AD8495ARMZ; BUILT_BY: EMA_UL_Team; MANUFACTURER_PART_NUMBER: AD8495ARMZ; SOURCELIBRARY: Analog_2015-12-15; VENDOR: Analog Devices Inc
U$2 = 3D_MIG_Controller:METER_BASE
U$3 = 3D_MIG_Controller:XTAL_25_MHZ
U$7 = 3D_MIG_Controller:VAR_10MM_VDRUS10
U$8 = 3D_MIG_Controller:C_AL_ELECTROLYTIC_SMD_220UF
X3 = 3D_MIG_Controller:XTAL_32.768KHZ
X4 = 3D_MIG_Controller:XTAL_24_MHZ

## Board
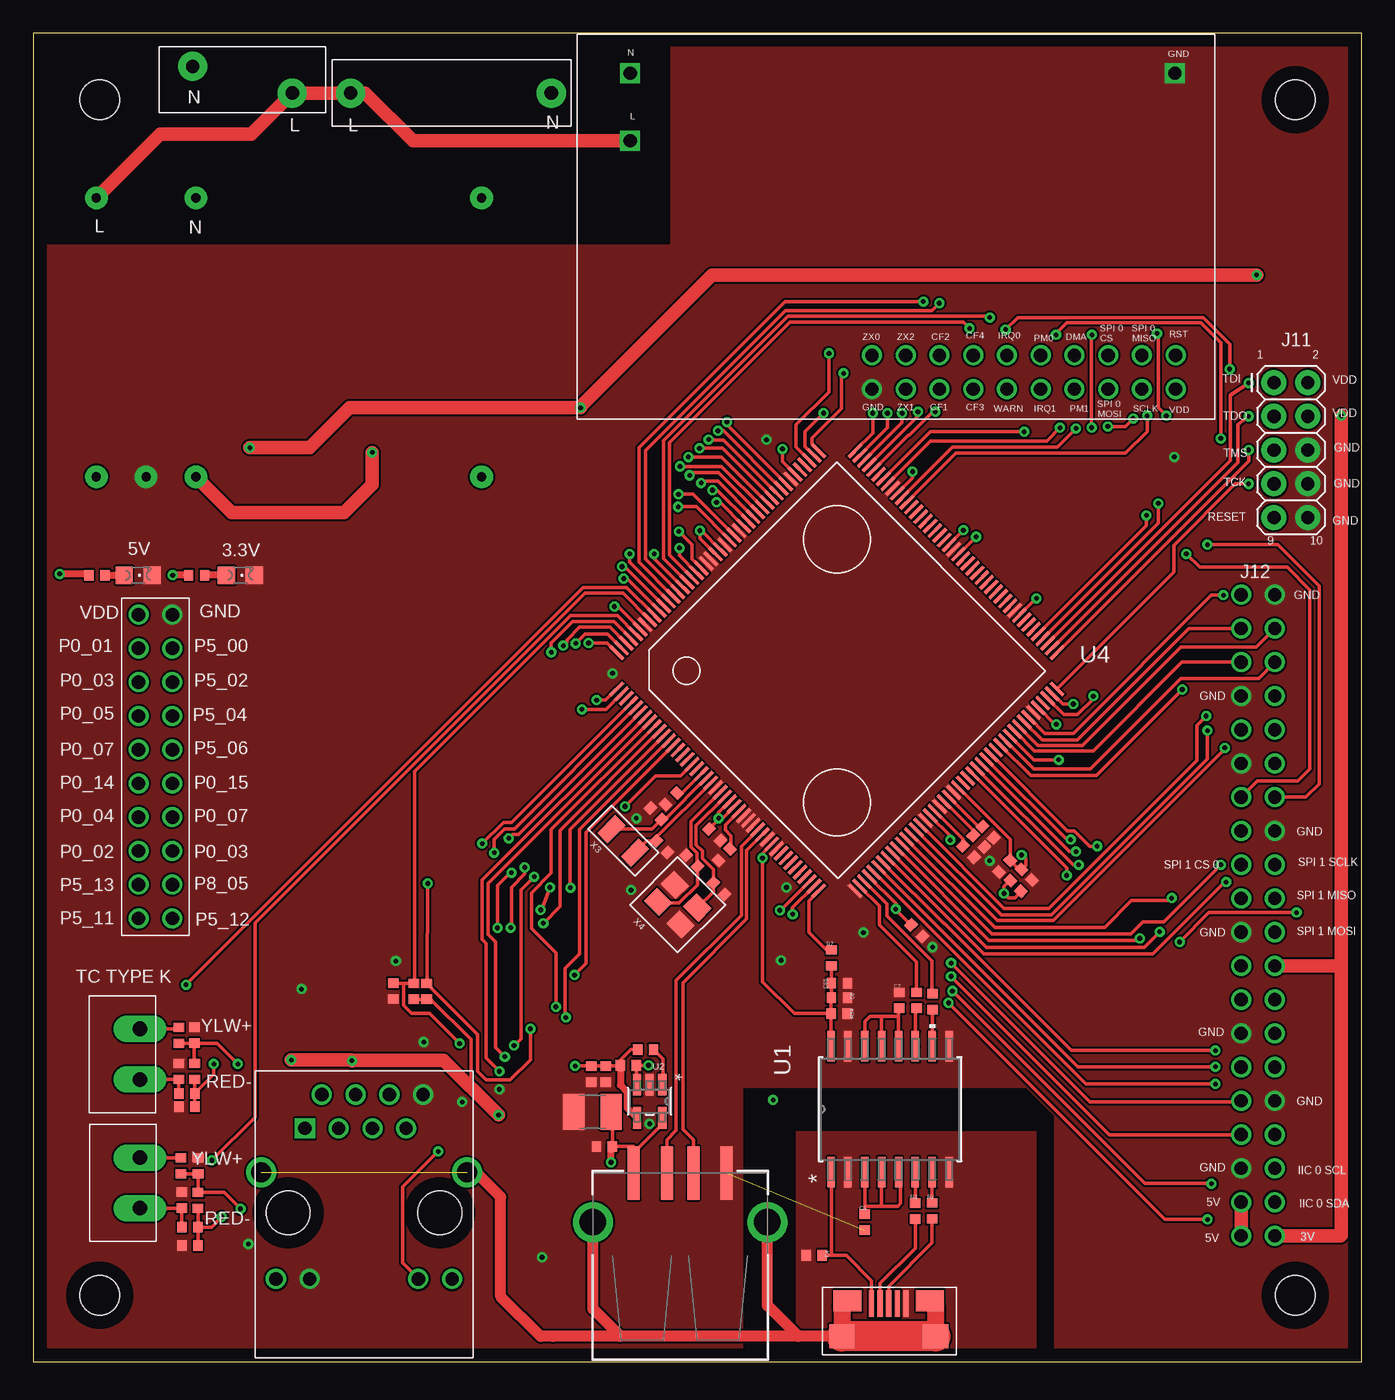
[diagram p8: board, top side]
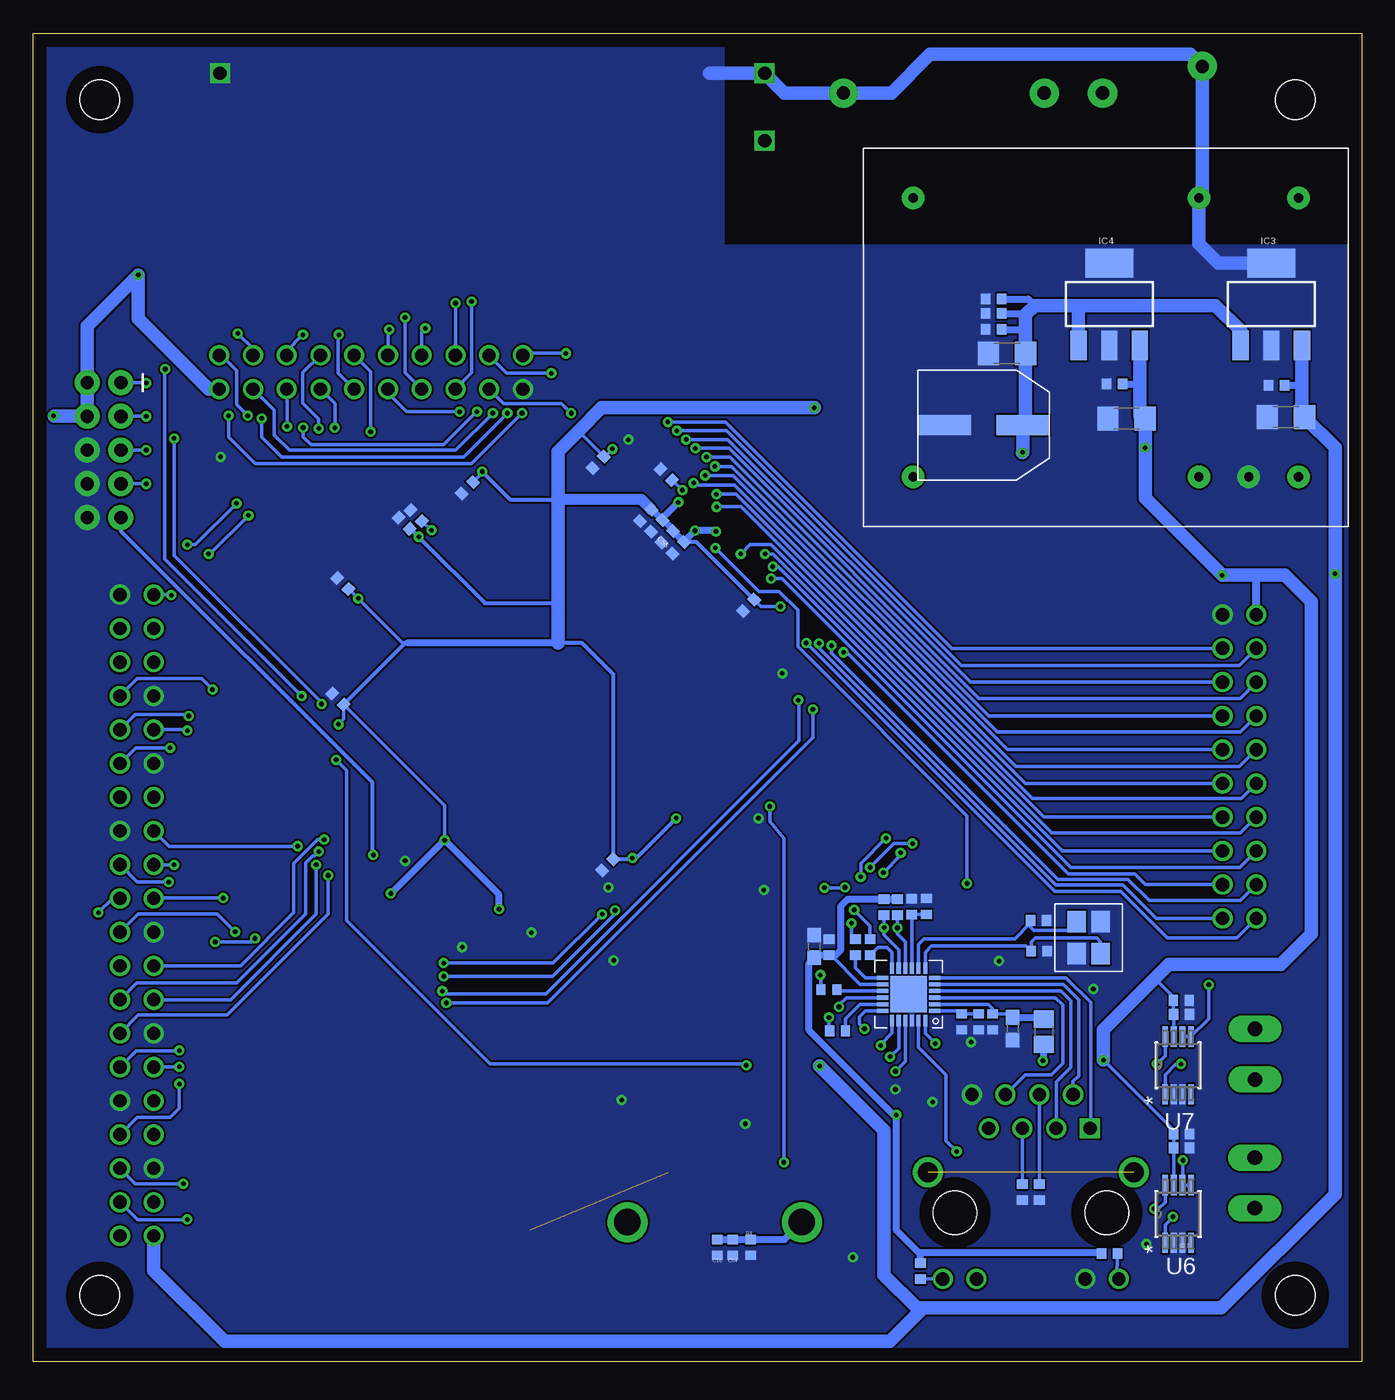
[diagram p9: board, bottom side, seen from below]

Size 100 x 100 mm. Coordinates in mm from the lower left corner, seen from the top.
Outline: 0,0 100,0 100,100 0,100 0,0
Copper layers (1*16): Top 0.035mm / dielectric 1.5mm / Bottom 0.035mm
Design rules "default": minimum track width 6mil, minimum drill 0.35mm, track to track 6mil, track to pad 6mil, pad to pad 6mil, via to via 6mil, smd to smd 6mil, copper to edge 40mil, drill to drill 6mil, minimum pad ring 10mil, minimum via ring 8mil, stop-mask expansion 4mil, vias tented up to drill 0mil, thermal gap 10mil
Holes 3 mm at 5,95 95,95 95,5 5,5

### Footprints (pad centres in the part's own frame; a part is rotated, then mirrored left to right if it is on the bottom)
0402 = smd 0.8 x 0.7: P$1 0,0.6; P$2 0,-0.6
C1210 = smd 1.6 x 2.7: 1 -1.4,0; 2 1.4,0
CAP_THIN_FILM_32922 = drill 1 pad 2.184: P$1 -0.1,0; P$2 15,0
C1206 = smd 1.6 x 1.8: 1 -1.4,0; 2 1.4,0
0603 = smd 1.1 x 1: 1 -0.85,0; 2 0.85,0
0805 = smd 1.3 x 1.5: 1 -0.95,0; 2 0.95,0
SOT223 = smd 1.219 x 2.235: 1 -2.311,-3.099; 2 0,-3.099; 3 2.311,-3.099 | smd 3.6 x 2.2: 4 0,3.099
2_X_10_.1_INCH = drill 1: P$1 -11.43,-1.27; P$2 -11.43,1.27; P$3 -8.89,-1.27; P$4 -8.89,1.27; P$5 -6.35,-1.27; P$6 -6.35,1.27; P$7 -3.81,-1.27; P$8 -3.81,1.27; P$9 -1.27,-1.27; P$10 -1.27,1.27; P$11 1.27,-1.27; P$12 1.27,1.27; P$13 3.81,-1.27; P$14 3.81,1.27; P$15 6.35,-1.27; P$16 6.35,1.27; P$17 8.89,-1.27; P$18 8.89,1.27; P$19 11.43,-1.27; P$20 11.43,1.27
USB_MICRO-B = smd 0.4 x 2: P$1 -1.3,2.475; P$2 -0.65,2.475; P$3 0,2.475; P$4 0.65,2.475; P$5 1.3,2.475 | smd 2.1 x 1.6: P$6 -3.1,2.675; P$7 3.1,2.675 | smd 1.9 x 1.8: P$8 -3.525,0; P$9 3.525,0
USB_A_SMT = smd 4 x 0.9: D+ 6.7,-1; D- 6.7,1; GND 6.7,-3.5; VBUS 6.7,3.5 | drill 2: SHLD1 3,-6.566; SHLD2 3,6.566
RJ45_TH_ELEC = drill 1 square: 1 -4.45,-2.54 | drill 1: 2 -3.18,0; 3 -1.91,-2.54; 4 -0.635,0; 5 0.635,-2.54; 6 1.91,0; 7 3.17,-2.54; 8 4.445,0; 9 -6.63,-13.88; 10 -4.09,-13.88; 11 4.09,-13.88; 12 6.63,-13.88 | drill 1.5: 13 -7.75,-5.84; 14 7.75,-5.84 | hole 3.299: 5.715,-8.89; -5.715,-8.89
2_3.81MM_PITCH = drill 1.1 pad 2 long: P$1 0,0; P$2 3.81,0
2X5 = drill 1 pad 1.88: 1 0,0; 2 0,2.54; 3 2.54,0; 4 2.54,2.54; 5 5.08,0; 6 5.08,2.54; 7 7.62,0; 8 7.62,2.54; 9 10.16,0; 10 10.16,2.54
HEADER_2_X_20_.1_INCH = drill 1: P$1 -24.13,-1.27; P$2 -24.13,1.27; P$3 -21.59,-1.27; P$4 -21.59,1.27; P$5 -19.05,-1.27; P$6 -19.05,1.27; P$7 -16.51,-1.27; P$8 -16.51,1.27; P$9 -13.97,-1.27; P$10 -13.97,1.27; P$11 -11.43,-1.27; P$12 -11.43,1.27; P$13 -8.89,-1.27; P$14 -8.89,1.27; P$15 -6.35,-1.27; P$16 -6.35,1.27; P$17 -3.81,-1.27; P$18 -3.81,1.27; P$19 -1.27,-1.27; P$20 -1.27,1.27; P$21 1.27,-1.27; P$22 1.27,1.27; P$23 3.81,-1.27; P$24 3.81,1.27; P$25 6.35,-1.27; P$26 6.35,1.27; P$27 8.89,-1.27; P$28 8.89,1.27; P$29 11.43,-1.27; P$30 11.43,1.27; P$31 13.97,-1.27; P$32 13.97,1.27; P$33 16.51,-1.27; P$34 16.51,1.27; P$35 19.05,-1.27; P$36 19.05,1.27; P$37 21.59,-1.27; P$38 21.59,1.27; P$39 24.13,-1.27; P$40 24.13,1.27
LED_0805_GREEN = smd 1.3 x 1.3: A 0,-1.05; C 0,1.05
RW_16_ADI-M = smd 2.286 x 0.559: 1 -4.737,4.445; 2 -4.737,3.175; 3 -4.737,1.905; 4 -4.737,0.635; 5 -4.737,-0.635; 6 -4.737,-1.905; 7 -4.737,-3.175; 8 -4.737,-4.445; 9 4.737,-4.445; 10 4.737,-3.175; 11 4.737,-1.905; 12 4.737,-0.635; 13 4.737,0.635; 14 4.737,1.905; 15 4.737,3.175; 16 4.737,4.445
SOT-23-5 = smd 1.626 x 0.61: 1 -1.245,0.95; 2 -1.245,0; 3 -1.245,-0.95; 4 1.245,-0.95; 5 1.245,0.95
QFN-24-M = smd 0.864 x 0.305: 1 -1.968,1.25; 2 -1.968,0.75; 3 -1.968,0.25; 4 -1.968,-0.25; 5 -1.968,-0.75; 6 -1.968,-1.25; 13 1.968,-1.25; 14 1.968,-0.75; 15 1.968,-0.25; 16 1.968,0.25; 17 1.968,0.75; 18 1.968,1.25 | smd 0.305 x 0.864: 7 -1.25,-1.968; 8 -0.75,-1.968; 9 -0.25,-1.968; 10 0.25,-1.968; 11 0.75,-1.968; 12 1.25,-1.968; 19 1.25,1.968; 20 0.75,1.968; 21 0.25,1.968; 22 -0.25,1.968; 23 -0.75,1.968; 24 -1.25,1.968 | smd 2.743 x 2.743: 25 0,0
LQFP176_24X24 = smd 1.372 x 0.254: 1 -12.675,10.75; 2 -12.675,10.25; 3 -12.675,9.75; 4 -12.675,9.25; 5 -12.675,8.75; 6 -12.675,8.25; 7 -12.675,7.75; 8 -12.675,7.25; 9 -12.675,6.75; 10 -12.675,6.25; 11 -12.675,5.75; 12 -12.675,5.25; 13 -12.675,4.75; 14 -12.675,4.25; 15 -12.675,3.75; 16 -12.675,3.25; 17 -12.675,2.75; 18 -12.675,2.25; 19 -12.675,1.75; 20 -12.675,1.25; 21 -12.675,0.75; 22 -12.675,0.25; 23 -12.675,-0.25; 24 -12.675,-0.75; 25 -12.675,-1.25; 26 -12.675,-1.75; 27 -12.675,-2.25; 28 -12.675,-2.75; 29 -12.675,-3.25; 30 -12.675,-3.75; 31 -12.675,-4.25; 32 -12.675,-4.75; 33 -12.675,-5.25; 34 -12.675,-5.75; 35 -12.675,-6.25; 36 -12.675,-6.75; 37 -12.675,-7.25; 38 -12.675,-7.75; 39 -12.675,-8.25; 40 -12.675,-8.75; 41 -12.675,-9.25; 42 -12.675,-9.75; 43 -12.675,-10.25; 44 -12.675,-10.75; 89 12.675,-10.75; 90 12.675,-10.25; 91 12.675,-9.75; 92 12.675,-9.25; 93 12.675,-8.75; 94 12.675,-8.25; 95 12.675,-7.75; 96 12.675,-7.25; 97 12.675,-6.75; 98 12.675,-6.25; 99 12.675,-5.75; 100 12.675,-5.25; 101 12.675,-4.75; 102 12.675,-4.25; 103 12.675,-3.75; 104 12.675,-3.25; 105 12.675,-2.75; 106 12.675,-2.25; 107 12.675,-1.75; 108 12.675,-1.25; 109 12.675,-0.75; 110 12.675,-0.25; 111 12.675,0.25; 112 12.675,0.75; 113 12.675,1.25; 114 12.675,1.75; 115 12.675,2.25; 116 12.675,2.75; 117 12.675,3.25; 118 12.675,3.75; 119 12.675,4.25; 120 12.675,4.75; 121 12.675,5.25; 122 12.675,5.75; 123 12.675,6.25; 124 12.675,6.75; 125 12.675,7.25; 126 12.675,7.75; 127 12.675,8.25; 128 12.675,8.75; 129 12.675,9.25; 130 12.675,9.75; 131 12.675,10.25; 132 12.675,10.75 | smd 0.254 x 1.372: 45 -10.75,-12.675; 46 -10.25,-12.675; 47 -9.75,-12.675; 48 -9.25,-12.675; 49 -8.75,-12.675; 50 -8.25,-12.675; 51 -7.75,-12.675; 52 -7.25,-12.675; 53 -6.75,-12.675; 54 -6.25,-12.675; 55 -5.75,-12.675; 56 -5.25,-12.675; 57 -4.75,-12.675; 58 -4.25,-12.675; 59 -3.75,-12.675; 60 -3.25,-12.675; 61 -2.75,-12.675; 62 -2.25,-12.675; 63 -1.75,-12.675; 64 -1.25,-12.675; 65 -0.75,-12.675; 66 -0.25,-12.675; 67 0.25,-12.675; 68 0.75,-12.675; 69 1.25,-12.675; 70 1.75,-12.675; 71 2.25,-12.675; 72 2.75,-12.675; 73 3.25,-12.675; 74 3.75,-12.675; 75 4.25,-12.675; 76 4.75,-12.675; 77 5.25,-12.675; 78 5.75,-12.675; 79 6.25,-12.675; 80 6.75,-12.675; 81 7.25,-12.675; 82 7.75,-12.675; 83 8.25,-12.675; 84 8.75,-12.675; 85 9.25,-12.675; 86 9.75,-12.675; 87 10.25,-12.675; 88 10.75,-12.675; 133 10.75,12.675; 134 10.25,12.675; 135 9.75,12.675; 136 9.25,12.675; 137 8.75,12.675; 138 8.25,12.675; 139 7.75,12.675; 140 7.25,12.675; 141 6.75,12.675; 142 6.25,12.675; 143 5.75,12.675; 144 5.25,12.675; 145 4.75,12.675; 146 4.25,12.675; 147 3.75,12.675; 148 3.25,12.675; 149 2.75,12.675; 150 2.25,12.675; 151 1.75,12.675; 152 1.25,12.675; 153 0.75,12.675; 154 0.25,12.675; 155 -0.25,12.675; 156 -0.75,12.675; 157 -1.25,12.675; 158 -1.75,12.675; 159 -2.25,12.675; 160 -2.75,12.675; 161 -3.25,12.675; 162 -3.75,12.675; 163 -4.25,12.675; 164 -4.75,12.675; 165 -5.25,12.675; 166 -5.75,12.675; 167 -6.25,12.675; 168 -6.75,12.675; 169 -7.25,12.675; 170 -7.75,12.675; 171 -8.25,12.675; 172 -8.75,12.675; 173 -9.25,12.675; 174 -9.75,12.675; 175 -10.25,12.675; 176 -10.75,12.675
TMLM04 = drill 0.7 pad 1.7: P$1 21,-25.25; P$2 21,-3.75; P$3 21,0; P$4 21,3.75; P$5 0,3.75; P$6 0,-3.75; P$7 0,-25.25
RM_8_ADI = smd 1.524 x 0.432: 1 -2.172,0.975; 2 -2.172,0.325; 3 -2.172,-0.325; 4 -2.172,-0.975; 5 2.172,-0.975; 6 2.172,-0.325; 7 2.172,0.325; 8 2.172,0.975
METER_BASE = drill 1: P1 22.2,2.276; P2 22.2,4.816; P3 24.74,2.276; P4 24.74,4.816; P5 27.28,2.276; P6 27.28,4.816; P7 29.82,2.276; P8 29.82,4.816; P9 32.36,2.276; P10 32.36,4.816; P11 34.9,2.276; P12 34.9,4.816; P13 37.44,2.276; P14 37.44,4.816; P15 39.98,2.276; P16 39.98,4.816; P17 42.52,2.276; P18 42.52,4.816; P19 45.06,2.276; P20 45.06,4.816 | drill 1 square: P21 4,26.046; P22 4,20.966; P23 45,26.046
SMD_3225 = smd 1.6 x 1.4: 1 -1.2,-0.9; 2 1.2,-0.9; 3 1.2,0.9; 4 -1.2,0.9
VAR_10MM_VDRUS10 = drill 1 pad 2.184: P$1 0,1; P$2 7.5,-1
C_AL_ELECTROLYTIC_SMD_220UF = smd 1.5 x 4: N- 0,2; P+ 0,7.9
SMD_X_2_PADS = smd 1.9 x 1.1: P$1 0,1.25; P$2 0,-1.25

### Placement (x,y rotation side)
C1  53.06,62.92 135 bottom
C2  52.27,62.09 135 bottom
C3  62.6,10.5 0 top
C4  58.8,8 270 top
C5  43.1,21.65 0 top
C6  60.69,27.4 270 top
C7  65.2,27.2 0 top
C8  42,21.65 0 top
C10  72.08,63.12 45 bottom
C11  43,16.2 270 top
C12  12.4,12.14 180 top
C13  76.7,58.57 45 bottom
C14  67.32,65.77 135 bottom
C15  42.1,18.8 180 top
C16  48.5,8.6 180 bottom
C17  11.8,8.75 90 top
C18  12.42,14.74 180 top
C19  13.56,16.09 90 bottom
C20  24,95.5 0 top
C21  27.7,77.7 270 bottom
C22  27.7,80 270 bottom
C23  26.7,75.9 180 bottom
C24  27.7,78.9 270 bottom
C25  18.6,73.6 270 bottom
C26  17.7,71 180 bottom
C27  6.4,73.5 270 bottom
C28  5.7,71.1 180 bottom
C29  13.55,17.13 90 bottom
C30  46.15,56.94 135 bottom
C31  70.4,38.4 45 top
C32  77.06,49.89 225 bottom
C33  12.15,21.85 180 top
C34  11.58,19.2 90 top
C35  12.13,24.57 180 top
C36  71.17,63.69 45 bottom
C37  52.34,66.77 45 bottom
C38  48.03,42.37 315 top
C39  24.26,12.77 0 bottom
C40  25.54,12.77 0 bottom
C41  24.27,30.89 90 bottom
C42  24.32,33.21 90 bottom
C43  26.26,25.06 270 bottom
C44  27.79,25.58 0 bottom
C45  28.82,25.58 0 bottom
C46  30.1,25.58 0 bottom
C47  33.86,34.24 180 bottom
C48  41.2,31.25 90 bottom
C49  40.1,31.2 180 bottom
C50  46.88,41.24 225 top
C51  47.32,38.77 45 top
C52  49.57,37.7 225 top
C53  51.62,35.6 45 top
C54  57.47,67.69 135 bottom
C55  51.44,61.27 135 bottom
C56  53.89,63.71 135 bottom
C57  73.12,37.3 315 top
C58  51.31,39.66 45 top
C59  74.76,35.84 135 top
C60  56.76,37.4 315 bottom
C61  66.51,32.44 225 top
C62  13.57,27.19 90 bottom
C63  13.55,26.14 90 bottom
C64  47.35,8.6 180 bottom
C65  60.69,28.49 90 top
FB2/2  23.92,24.83 90 bottom
IC3  6.8,79.6 0 bottom
IC4  19,79.6 0 bottom
J1  9.2,44.8 90 top
J2  64.4,1.9 0 top
J3  48.7,7.5 90 top
J4  24.9,20.1 0 top
J6  8.04,15.36 270 top
J7  8.03,25.05 270 top
J11  93.4,73.7 270 top
J12  92.2,33.6 90 top
LED3  15.6,59.2 270 top
LED4  7.9,59.2 270 top
R1  46.1,23.5 270 top
R2  67.67,11.35 0 top
R3  66.4,11.34 0 top
R4  46,8.6 0 bottom
R5  66.5,27.2 0 top
R6  67.7,27.1 0 top
R7  60.09,30.39 0 top
R8  12.3,59.2 90 top
R9  4.8,59.2 90 top
R11  11.12,14.74 0 top
R12  44.8,22.3 270 top
R13  11.8,10.13 90 top
R14  11.19,12.16 0 top
R15  10.96,24.56 0 top
R16  71.87,39.86 225 top
R17  71.18,39.17 225 top
R18  73.97,36.63 315 top
R19  52.02,38.16 135 top
R20  11.57,20.19 90 top
R21  10.96,21.85 0 top
R23  33.21,6.82 180 bottom
R24  18.97,8.14 270 bottom
R25  32.76,34.27 0 bottom
R26  29.61,27.88 0 top
R27  28.64,27.88 0 top
R28  35.96,34.22 180 bottom
R29  34.94,34.22 180 bottom
R30  37,31.2 0 bottom
R31  38.1,31.2 0 bottom
R32  39.45,24.9 90 bottom
R33  40.1,28 90 bottom
R34  60.67,26.2 270 top
U1  64.5,19 90 top
U2  46.4,19.6 270 top
U3  34.1,27.65 180 bottom
U4  60.5,52 45 top
U5  8.5,87.6 270 bottom
U6  13.82,11.11 90 bottom
U7  13.82,22.3 90 bottom
U$2  40.94,70.94 0 top
U$3  20.55,31.91 270 bottom
U$4  27.11,27.9 0 top
U$7  19.5,96.5 180 top
U$8  33.4,70.5 270 bottom
X3  44.41,39.2 45 top
X4  48.51,34.39 315 top

### Tracks (layer width: path | path; a pad name or v marks a point on that pad's centre or on a via)
1_IN+  (via drill 0.35)
  Top 0.254: R11.P$2 C18.P$1 12.42,12.76 C12.P$2 14.36,12.74 v15.6,11.5
  Bottom 0.254: v15.6,11.5 15.3,11.5 14.79,12.01 U6.8
1_IN-  (via drill 0.35)
  Top 0.254: C12.P$1 R13.P$2 | R13.P$2 C17.P$2 | R13.P$2 13.43,10.13 v14.2,10.9
  Bottom 0.254: v14.2,10.9 14.79,10.3 U6.1
1_RED-
  Top 0.254: J6.P$2 R14.P$2 R13.P$1
1_V_KT  (via drill 0.35)
  Top 0.254: U4.169 44.4,57.85 41.53,57.85 16.7,33.02 16.7,18.4 v13.45,15.15
  Bottom 0.254: v13.45,15.15 13.45,13.33 U6.6 U6.5
1_YLW+
  Top 0.254: J6.P$1 11.1,15.36 R11.P$1
2_IN+  (via drill 0.35)
  Top 0.254: R15.P$2 C35.P$1 | C35.P$1 13.83,23.97 v15.4,22.4 | C33.P$2 12.12,22.48 C35.P$1
  Bottom 0.254: v15.4,22.4 14.79,23 U7.8
2_IN-  (via drill 0.35)
  Top 0.254: C34.P$2 R20.P$2 | R20.P$2 12.17,21.23 C33.P$1 | R20.P$2 13.6,21.62 v13.6,22.4
  Bottom 0.254: v13.6,22.4 14,22.4 14.79,21.61 U7.1
2_RED-
  Top 0.254: J7.P$2 R21.P$2 R20.P$1
2_V_KT  (via drill 0.35)
  Top 0.254: v11.51,28.37 11.51,28.41 41.38,58.29 44.67,58.29 U4.168
  Bottom 0.254: v11.51,28.37 11.51,25.81 U7.5 U7.6
2_YLW+
  Top 0.254: J7.P$1 10.85,25.05 R15.P$1
C58
  Bottom 0.254: C39.P$1 J4.4
C60
  Bottom 0.254: J4.5 C40.P$1
CF1  (via drill 0.35)
  Top 0.254: U4.164 45.6,60.18 45.6,68.8 56.6,79.8 v67,79.8
  Bottom 0.254: U$2.P5 67,74.44 v67,79.8
CF2  (via drill 0.35)
  Top 0.254: U4.163 46.08,60.41 46.08,68.58 56.62,79.12 67.65,79.12 v68.21,79.68
  Bottom 0.254: v68.21,79.68 U$2.P6
CF3  (via drill 0.35)
  Top 0.254: U4.161 47.44,60.46 47.44,69.34 56.8,78.69 71.91,78.69 v72,78.6
  Bottom 0.254: v72,78.6 72,74.46 U$2.P7
CF4  (via drill 0.35)
  Top 0.254: U4.160 47.89,60.72 47.89,69.19 56.96,78.26 70,78.26 v70.48,77.78
  Bottom 0.254: v70.48,77.78 70.76,77.51 U$2.P8
CRS_DV
  Bottom 0.254: U3.15 39.4,27.9 R33.P$2
D-
  Top 0.254: U1.11 66.41,26.5 R5.P$2
  Top 0.4: U1.11 66.5,23.74
DMA  (via drill 0.35)
  Top 0.254: U4.122 69.21,68.84 77.1,68.84 v78.5,70.24
  Bottom 0.254: v78.5,70.24 78.5,70.94 79.7,72.14 79.7,74.44 U$2.P14
ETH  (via drill 0.35)
  Top 0.254: v39.35,26.7 39.35,30.75 37.5,32.6 37.5,35.3 39,36.8 39,40.05 U4.9
  Bottom 0.254: U3.16 38.8,27.4 39.35,26.85 v39.35,26.7
ETH_CRS_DV  (via drill 0.35)
  Top 0.254: v40.75,29.1 41.63,29.98 41.63,39.85 U4.13
  Bottom 0.254: v40.75,29.1 40.7,29.05 R33.P$1
ETH_IRQ14  (via drill 0.35)
  Top 0.254: v37.43,25.05 37.43,22.73 35.89,21.19 34.11,21.19 33.46,21.84 33.46,24.63 R26.P$1 29.65,28.52 29.68,35.98 v29.7,36 | v48.65,61.26 48.65,60.67 U4.159
  Bottom 0.254: U3.18 37.35,26.4 37.8,25.95 37.8,25.42 v37.43,25.05 | v29.7,36 29.7,41.07 42.45,53.82 42.45,56.56 43.85,57.96 45.35,57.96 v48.65,61.26
ETH_MDC  (via drill 0.35)
  Top 0.254: v33.8,39 35.4,40.6 36.02,40.6 U4.4 | v37,37.2 37,36.7 36,35.7 36,32.71 v35.95,32.66
  Bottom 0.254: U3.11 34.85,31 35.96,32.11 v35.95,32.66 R28.P$1 | v33.8,39 35.2,39 v37,37.2
ETH_MDIO  (via drill 0.35)
  Top 0.254: v34.94,32.65 34.94,35.85 35.89,36.8 v36,36.8 | v34.7,38.3 34.7,39.3 35.5,40.1 36.23,40.1 U4.5
  Bottom 0.254: U3.10 34.35,31.6 34.94,32.19 v34.94,32.65 R29.P$1 | v34.7,38.3 34.7,38.1 v36,36.8
ETH_RESET  (via drill 0.35)
  Top 0.254: U4.172 43.97,56.15 40.44,56.15 28.7,44.41 28.7,28.54 R27.P$1 27.9,28.48 | 27.9,28.48 27.13,28.48 U$4.P$1 | 27.9,28.48 27.9,26.8 28.5,26.2 29.85,26.2 v32.1,23.95
  Bottom 0.254: U3.24 32.85,24.7 v32.1,23.95
ETH_RX_ER  (via drill 0.35)
  Top 0.254: v40.1,25.9 40.05,25.95 40.05,29.6 41.13,30.68 41.13,40.05 U4.12
  Bottom 0.254: R32.P$1 40.1,24.95 v40.1,25.9
ETH_RXD0  (via drill 0.35)
  Top 0.254: v38.4,33 39.65,34.25 39.65,39.99 U4.10
  Bottom 0.254: v38.4,33 38.4,32.1 R31.P$1
ETH_RXD1  (via drill 0.35)
  Top 0.254: v38.9,35.69 38.29,34.09 v38.2,34 | v40.44,35.67 40.4,35.71 40.4,40.05 47.47,47.12 U4.11
  Bottom 0.254: v38.2,34 37,32.8 R30.P$1 | v40.44,35.67 38.93,35.66 v38.9,35.69
ETH_TXD0  (via drill 0.35)
  Top 0.254: v35.5,22.95 34.8,23.65 34.8,31.6 34.25,32.15 34.25,36 U4.8
  Bottom 0.254: U3.20 34.85,23.6 v35.5,22.95
ETH_TXD1  (via drill 0.35)
  Top 0.254: v35.1,21.85 34.1,22.85 34.1,31.5 33.8,31.8 33.8,36.24 46.06,48.5 U4.7
  Bottom 0.254: U3.21 34.35,22.6 v35.1,21.85
ETH_TXD_EN  (via drill 0.35)
  Top 0.254: v36.2,23.8 36.71,24.31 36.71,35.5 v37.71,36.5 | v35.8,39.4 36.09,39.69 36.53,39.69 U4.6
  Bottom 0.254: U3.19 35.35,24.75 36.2,23.9 v36.2,23.8 | v35.8,39.4 35.83,39.4 37.71,37.52 v37.71,36.5
GND  (via drill 0.35)  (1 unrouted)
  Bottom 1.016: 49.1,97 44.95,97 U$2.P21 43.45,95.5 C20.P$2 35.4,95.5 32.5,98.4 12.9,98.4 U$7.P$2 12,87.85 U5.P$6 12.25,84.15 10.8,82.7 IC3.4
  other vias: 29.4,24.05 32.3,19.55 27.3,30.15 38.3,7.85 16.2,8.85 20.2,28.05 35.1,20.5 46.4,17.9 45,35.5 43.61,51.82 62.5,32.3 72,37.7 45.4,40.9 67.7,31.2 85.9,68.1 55.7,19.7 56.3,30.2 56.7,35.7 55.2,69.4
  pour Bottom (no thermals): 0,0.1 100,0.1 100,100 48,100 48,84.1 0,84.1
  pour Top (no thermals): 0,84.1 48,84.1 48,100 100,100 100,-0.01 76.9,-0.01 76.9,18.5 74.8,20.6 53.4,20.6 53.4,0.1 0,0.1
GND2
  pour Top (no thermals): 75.5,0 75.5,17.3 57.4,17.3 57.4,0
GNDE  (1 unrouted)
  Top 0.508: 39,1.8 39.1,1.9
  Top 0.813: 68.33,1.5 J2.P$9 | J2.P$7 67.92,4.15 | J2.P$6 60.88,4.15 | J2.P$8 57.6,1.9 | J3.SHLD1 55.27,4.23 57.6,1.9 | 57.6,1.9 44.2,1.9 | J3.SHLD2 42.13,3.97 44.2,1.9 | 44.2,1.9 39.1,1.9 38.2,1.9 35.2,4.9 35.2,12.4 33.34,14.26 J4.14
  Top 1.27: 67.92,4.15 J2.P$9 | 60.88,4.15 J2.P$8
  Top 2.25: J2.P$9 J2.P$8
  Bottom 0.508: C16.P$2 C64.P$2 R4.P$1 43.43,9.2 J3.SHLD2
GP4  (via drill 0.35)
  Top 0.254: v89,20.9 79.23,20.9 U4.49
  Bottom 0.254: J12.P$7 92.17,18.39 89.67,18.39 89,19.06 v89,20.9
GP5  (via drill 0.35)
  Top 0.254: U4.57 72.58,33.2 76.8,33.2 89.7,46.1 v89.7,46.2
  Bottom 0.254: J12.P$29 92.3,46.2 v89.7,46.2
GP6  (via drill 0.35)
  Top 0.254: U4.59 66.88,40.31 73.08,34.11 76.45,34.11 87.6,45.26 87.6,47.9 v88.3,48.6
  Bottom 0.254: v88.3,48.6 88.4,48.7 92.34,48.7 J12.P$31
GP12  (via drill 0.35)
  Top 0.254: U4.58 72.87,33.62 76.64,33.62 88.4,45.38 v88.4,47.5
  Bottom 0.254: v88.4,47.5 88.47,47.57 J12.P$32
GP13  (via drill 0.35)
  Top 0.254: U4.76 75.09,44.13 80.03,44.13 v86.5,50.6
  Bottom 0.254: v86.5,50.6 87.32,51.42 92.18,51.42 93.47,50.13 J12.P$33
GP14  (via drill 0.35)
  Top 0.254: U4.42 56.26,33.97 v56.2,33.97 | v69.1,29 81.01,17.09 J12.P$8
  Bottom 0.254: v69.1,29 60.89,29 56.2,33.69 v56.2,33.97
GP15  (via drill 0.35)
  Top 0.254: U4.43 57.17,34.18 v57.17,33.68 | v69.1,30 79.56,19.54 90.84,19.54 J12.P$10
  Bottom 0.254: v57.17,33.68 60.85,30 v69.1,30
GP16
  Top 0.254: U4.79 73.89,47.46 75.36,45.99 79.79,45.99 86.45,52.65 J12.P$36
GP17  (via drill 0.35)
  Top 0.254: U4.51 68.57,32.97 68.61,32.97 78.16,23.42 v89,23.42
  Bottom 0.254: v89,23.42 89.02,23.4 92.24,23.4 J12.P$11
GP18  (via drill 0.35)
  Top 0.254: U4.50 78.63,22.2 v89,22.2
  Bottom 0.254: v89,22.2 90.9,22.2 J12.P$12
GP19
  Top 0.254: U4.77 75.32,44.6 79.57,44.6 86.4,51.43 92.25,51.43 J12.P$35
GP20
  Top 0.254: U4.81 75.95,46.8 78.6,46.8 86.99,55.19 J12.P$38
GP21  (via drill 0.35)
  Top 0.254: v89.6,57.7 88.7,57.7 78.3,47.3 76.16,47.3 U4.82
  Bottom 0.254: J12.P$40 89.63,57.73 v89.6,57.7
GP22  (via drill 0.35)
  Top 0.254: U4.72 77.99,38.4 v78.5,38.4
  Bottom 0.254: v78.5,38.4 78.84,38.06 78.97,38.06 79.5,37.53 79.5,33.7 84.7,28.5 92.22,28.5 J12.P$15
GP23  (via drill 0.35)
  Top 0.254: U4.71 78.28,37.4 v78.7,37.4
  Bottom 0.254: J12.P$16 85.15,27.25 78.7,33.7 v78.7,37.4
GP24  (via drill 0.35)
  Top 0.254: v78.1,39.3 77.8,39.3 U4.73
  Bottom 0.254: J12.P$18 84.4,29.8 80.4,33.8 80.4,37.5 78.6,39.3 v78.1,39.3
GP25  (via drill 0.35)
  Top 0.254: v85.7,34.9 85.5,34.7 82.67,34.7 80.66,32.69 72.38,32.69 U4.56
  Bottom 0.254: v85.7,34.9 90.9,34.9 J12.P$22
GP26
  Top 0.254: U4.80 74.23,47.79 75.64,46.39 78.99,46.39 86.4,53.8 92.08,53.8 J12.P$37
GP27  (via drill 0.35)
  Top 0.254: v77.8,36.6 77.8,37.17 U4.70
  Bottom 0.254: J12.P$13 92.08,26.1 85.4,26.1 77.8,33.7 v77.8,36.6
ID_SC  (via drill 0.35)
  Top 0.254: J12.P$28 92.14,43.7 95.2,43.7 96.1,44.6 96.1,58.1 94.4,59.8 87.8,59.8 v86.8,60.8 | U4.93 75.7,54.83 83.8,62.93 v83.8,63.7
  Bottom 0.254: v86.8,60.8 86.7,60.8 v83.8,63.7
ID_SD  (via drill 0.35)
  Top 0.254: U4.92 84.7,63.12 v84.7,64.6 | v88.4,61.5 93.7,61.5 96.8,58.4 96.8,43.5 95.79,42.49 J12.P$27
  Bottom 0.254: v84.7,64.6 87.8,61.5 v88.4,61.5
IIC_0_SCL  (via drill 0.35)
  Top 0.254: U4.1 43.1,49.8 v42.4,49.8 | v69.2,27.89 83.67,13.43 88.67,13.43 v88.7,13.4
  Bottom 0.254: v42.4,49.8 42.34,49.74 42.34,46.75 61.4,27.69 69,27.69 v69.2,27.89 | v88.7,13.4 92.32,13.4 J12.P$5
IIC_0_SDA  (via drill 0.35)
  Top 0.254: U4.2 43.1,49.1 v41.3,49.1 | v88.4,10.7 85.2,10.7 v68.9,27
  Bottom 0.254: v41.3,49.1 41.3,47 61.3,27 v68.9,27 | v88.4,10.7 88.42,10.68 92.14,10.68 J12.P$3
IRQ0  (via drill 0.35)
  Top 0.254: v79.8,50.1 79.8,49.9 78.6,48.7 77.59,48.7 U4.86 | v90.06,74.71 90.06,76.61 88.07,78.61 74.11,78.61 v73.2,77.7
  Bottom 0.254: v79.8,50.1 90.1,60.4 90.1,74.67 v90.06,74.71 | v73.2,77.7 73.3,77.6 U$2.P10
IRQ1  (via drill 0.35)
  Top 0.254: U4.87 77.5,49.5 v78.3,49.5 | v89.39,69.5 89.39,76.71 87.9,78.2 77.8,78.2 77,77.4 v77,77.3
  Bottom 0.254: v89.39,69.5 89.39,60.69 78.3,49.6 v78.3,49.5 | v77,77.3 77.05,77.25 77.05,74.42 U$2.P11
LED1/SPEED  (via drill 0.35)
  Top 0.254: J4.11 28.99,6.29 27.82,7.45 27.82,13.15 v30.48,15.81
  Bottom 0.254: U3.23 33.35,23.65 31.3,21.6 31.3,16.63 v30.48,15.81
N$1  (via drill 0.35)
  Top 0.254: U4.148 51.49,65.61 v51.14,65.61
  Bottom 0.254: C37.P$2 51.9,66.37 | 51.9,66.37 | v51.14,65.61 51.9,66.37
N$2
  Top 0.254: J2.P$2 63.75,5.89 66.4,8.54 R3.P$2
N$3
  Top 0.254: R2.P$1 U1.7
N$4
  Top 0.254: U4.19 48.82,42.8 C38.P$1
N$5
  Top 0.254: U4.62 69.98,39.34 C31.P$1
N$6
  Top 0.254: R17.P$2 70.76,39.97 U4.64
N$7
  Top 0.254: U4.65 71.15,40.29 R16.P$2
N$8
  Top 0.254: U4.27 52.1,40.42 52.1,40.03 52.54,39.59 52.54,38.68 R19.P$2
N$9
  Top 0.508: LED3.A R8.P$2
N$10
  Top 0.508: R9.P$2 LED4.A
N$11
  Top 0.254: J2.P$1 63.1,6.1 61.2,8 60.1,8 | 60.1,8 C4.P$1 | U1.1 60.1,14.22 60.1,8
N$12
  Top 0.254: R3.P$1 U1.6
N$13
  Top 0.254: R2.P$2 67.67,8.95 64.4,5.67 J2.P$3
N$14
  Top 0.254: C3.P$1 62.6,11.7 | 62.6,11.7 U1.3 | U1.5 65.3,14.1 65.3,11.9 65.1,11.7 63.9,11.7 | 63.9,11.7 62.6,11.7 | U1.4 63.87,11.73 63.9,11.7
N$15
  Top 0.254: 65.1,23.8 65.14,23.77 U1.12 65.14,26 | 63.9,23.3 63.87,23.34 U1.13 63.87,25.86 64,26 | 65.14,26 65.14,26.54 C7.P$2 | U1.14 62.59,25.59 63,26 64,26 | 64,26 65.14,26
N$16
  Top 0.254: U1.10 67.67,26.48 R6.P$2
P0_02  (via drill 0.35)
  Top 0.254: U4.167 44.71,58.95 v44.45,58.95
  Bottom 0.254: J1.P$6 9.18,37.2 21.87,37.2 43.62,58.95 v44.45,58.95
P0_03  (via drill 0.35)
  Top 0.254: v44.32,59.85 44.52,59.85 U4.166
  Bottom 0.254: J1.P$5 22.55,38.45 43.95,59.85 v44.32,59.85
P0_04  (via drill 0.35)
  Top 0.254: v44.9,60.8 44.9,60.17 U4.165
  Bottom 0.254: J1.P$8 9.12,39.8 23.32,39.8 44.32,60.8 v44.9,60.8
P0_07  (via drill 0.35)
  Top 0.254: v46.74,60.8 46.74,60.46 U4.162
  Bottom 0.254: J1.P$7 23.94,40.99 44.45,61.5 46.04,61.5 v46.74,60.8
P0_14  (via drill 0.35)
  Top 0.254: v48.55,64.35 49.92,64.35 U4.152
  Bottom 0.254: J1.P$10 9.06,42.4 24.77,42.4 46.72,64.35 v48.55,64.35
P0_15  (via drill 0.35)
  Top 0.254: U4.151 49.67,65.3 v48.58,65.3
  Bottom 0.254: J1.P$9 25.33,43.53 47.1,65.3 v48.58,65.3
P5_00  (via drill 0.35)
  Top 0.254: v52.23,70.74 52.23,70.54 56.66,66.11 U4.140
  Bottom 0.254: J1.P$17 30.84,53.69 47.89,70.74 v52.23,70.74
P5_01  (via drill 0.35)
  Top 0.254: U4.141 56.3,65.73 51.96,70.07 v51.55,70.07
  Bottom 0.254: J1.P$18 9.22,52.4 30.13,52.4 47.82,70.1 51.52,70.1 v51.55,70.07
P5_02  (via drill 0.35)
  Top 0.254: v50.85,69.42 50.88,69.39 51.97,69.39 55.96,65.4 U4.142
  Bottom 0.254: J1.P$15 29.45,51.15 47.72,69.42 v50.85,69.42
P5_03  (via drill 0.35)
  Top 0.254: v50.16,68.76 51.87,68.76 U4.143
  Bottom 0.254: J1.P$16 9.15,49.93 28.81,49.93 47.64,68.76 v50.16,68.76
P5_04  (via drill 0.35)
  Top 0.254: v49.32,68.1 51.83,68.1 U4.144
  Bottom 0.254: J1.P$13 28.06,48.61 47.55,68.1 v49.32,68.1
P5_05  (via drill 0.35)
  Top 0.254: v48.68,67.39 51.82,67.39 U4.145
  Bottom 0.254: J1.P$14 9.14,47.4 27.43,47.4 47.42,67.39 v48.68,67.39
P5_06  (via drill 0.35)
  Top 0.254: v49.42,66.72 49.63,66.93 51.58,66.93 U4.146
  Bottom 0.254: J1.P$11 26.67,46.07 47.32,66.72 v49.42,66.72
P5_07  (via drill 0.35)
  Top 0.254: v50.28,66.15 50.4,66.27 51.53,66.27 U4.147
  Bottom 0.254: J1.P$12 9.2,44.8 26.02,44.8 47.22,66 50.13,66 v50.28,66.15
P5_11  (via drill 0.35)
  Top 0.254: v41.8,54.1 43.2,54.1 U4.176
  Bottom 0.254: J1.P$2 9.4,31.9 14.64,31.9 18.13,35.39 23.09,35.39 v41.8,54.1
P5_12  (via drill 0.35)
  Top 0.254: v40.84,54.06 41.53,54.76 43.25,54.76 U4.175
  Bottom 0.254: J1.P$1 15.44,33.37 17.97,35.9 23.02,35.9 40.84,53.71 v40.84,54.06
P5_13  (via drill 0.35)
  Top 0.254: v39.9,53.9 40.18,54.18 40.18,54.34 41.14,55.3 43.41,55.3 U4.174
  Bottom 0.254: J1.P$4 9.14,34.7 15.99,34.7 17.6,36.3 22.85,36.3 39.9,53.35 v39.9,53.9
P8_05  (via drill 0.35)
  Top 0.254: v39,53.4 39,54.1 40.61,55.71 43.71,55.71 U4.173
  Bottom 0.254: J1.P$3 16.27,35.91 17.07,36.71 22.08,36.71 38.77,53.4 v39,53.4
PM0  (via drill 0.35)
  Top 0.254: U4.126 67.54,70 v74.6,70
  Bottom 0.254: v74.6,70 74.6,74.52 U$2.P12
PM1  (via drill 0.35)
  Top 0.254: U4.125 67.55,69.3 76.3,69.3 v77.3,70.3
  Bottom 0.254: 78.32,73.22 U$2.P13 77.28,72.12 77.28,70.32 v77.3,70.3
R51
  Bottom 0.254: R23.P$1 J4.12
R52
  Bottom 0.254: R24.P$1 18.45,6.22 J4.9
RESET  (via drill 0.35)
  Top 0.254: 74.4,38.14 v74.41,38.15 74.71,37.85 74.71,37.37 R18.P$1 74.21,37.06 C57.P$1 73.54,39.31 U4.67
  Bottom 0.305: J11.9 93.4,62.54 74.51,43.65 74.51,38.25 v74.41,38.15
REXT
  Bottom 0.254: U3.9 33.85,33.63 C47.P$1 33.83,33.67 R25.P$2
RST  (via drill 0.35)
  Top 0.254: U4.121 69.47,68.4 82.23,68.4 83.86,70.03 v83.86,71.2
  Bottom 0.254: v83.86,71.2 84.7,72.04 84.7,74.6 85.86,75.76 U$2.P20
RXD0
  Bottom 0.254: U3.13 37.35,28.9 38.1,29.65 R31.P$2
RXD1
  Bottom 0.254: U3.12 35.35,30.8 35.75,31.2 36.4,31.2 R30.P$2
RXER
  Bottom 0.254: U3.17 37.75,26.9 38.85,25.8 R32.P$2
RXM
  Bottom 0.254: J4.6 25.31,21.6 23.35,21.6 22.5,22.45 22.5,26.85 23.05,27.4 U3.3
RXP
  Bottom 0.254: U3.4 22.65,27.9 21.89,27.14 21.89,22.16 22.99,21.06 J4.3
SPI_0_CS_0  (via drill 0.35)
  Top 0.254: U4.129 66.6,71.18 v66.6,71.5 | v79.7,77.3 79.67,77.27 79.67,70.33 v79.69,70.31
  Bottom 0.254: v66.6,71.5 66.61,71.5 69.1,69.02 79.08,69.02 79.69,69.61 v79.69,70.31 | v79.7,77.3 80.92,76.08 U$2.P16
SPI_0_MISO  (via drill 0.35)
  Top 0.254: U4.132 63.2,69.9 v63.2,71.4 | v85.3,71.2 84.7,71.8 84.7,77.3 v84.6,77.4
  Bottom 0.254: v63.2,71.4 67,67.6 83.3,67.6 85.3,69.6 v85.3,71.2 | v84.6,77.4 83.46,76.26 U$2.P18
SPI_0_MOSI  (via drill 0.35)
  Top 0.254: U4.131 64.31,70.3 v64.31,71.4 | v82.8,71 82.2,70.4 v80.9,70.4
  Bottom 0.254: v82.8,71 82.8,69.6 81.3,68.1 67.61,68.1 v64.31,71.4 | v80.9,70.4 80.9,73.2 U$2.P15
SPI_0_SCLK  (via drill 0.35)
  Top 0.254: U4.130 65.4,70.69 v65.4,71.4
  Bottom 0.254: v65.4,71.4 68.2,68.6 80.7,68.6 81.86,69.76 81.86,71.62 U$2.P17
SPI_1_CS_0  (via drill 0.35)
  Top 0.254: U4.55 72.17,32.2 78.6,32.2 82.61,32.2 83.53,33.12 85.11,33.12 v89.4,37.4
  Bottom 0.254: v89.4,37.4 J12.P$24
SPI_1_CS_1  (via drill 0.35)
  Top 0.254: U4.74 77.85,39.96 78.37,39.96 79.53,38.8 v80.1,38.8
  Bottom 0.254: v80.1,38.8 89.78,38.8 J12.P$26
SPI_1_MISO  (via drill 0.35)
  Top 0.254: U4.54 71.95,31.71 78.6,31.71 83.15,31.71 v83.3,31.86 | v86.3,31.6 88.5,33.8 v95.1,33.8
  Bottom 0.254: v86.3,31.6 83.56,31.6 v83.3,31.86 | v95.1,33.8 94.03,34.87 J12.P$21
SPI_1_MOSI  (via drill 0.35)
  Top 0.254: U4.53 71.75,31.2 78.6,31.2 83.64,31.2 v84.8,32.36
  Bottom 0.254: v84.8,32.36 86.14,33.7 92.1,33.7 J12.P$19
SPI_1_SCLK  (via drill 0.35)
  Top 0.254: U4.52 71.55,30.7 78.8,30.7 84.3,30.7 89.7,36.1 v89.8,36.1
  Bottom 0.254: v89.8,36.1 92.16,36.1 J12.P$23
TCK  (via drill 0.35)
  Top 0.254: U4.88 85.86,59.44 85.86,61.44 90.5,66.08 v91.5,66.08
  Bottom 0.254: v91.5,66.08 J11.7
TDI  (via drill 0.35)
  Top 0.254: U4.91 90.12,67.83 90.12,72.78 v91.5,73.68
  Bottom 0.254: J11.1 91.5,73.7 v91.5,73.68
TDO  (via drill 0.35)
  Top 0.254: v91.5,71.16 90.69,70.53 90.69,67.69 U4.90
  Bottom 0.254: v91.5,71.16 J11.3
TMS  (via drill 0.35)
  Top 0.254: v91.5,68.62 91.51,67.81 U4.89
  Bottom 0.254: J11.5 v91.5,68.62
TXM
  Bottom 0.254: U3.5 22.45,28.4 21.3,27.25 21.3,21.5 21.72,21.08 J4.2
TXP
  Bottom 0.254: U3.6 22.25,28.9 20.4,27.05 20.4,17.61 J4.1
UC
  Top 1.016: U$2.P22 28.59,91.91 25,95.5 C20.P$1 U$7.P$1 16.4,92.4 9.55,92.4 U5.P$5
USB_N
  Top 0.254: U4.46 63.71,34.29 63.71,32.89 66.5,30.1 R5.P$1
USB_P
  Top 0.254: R6.P$1 67.65,27.7 67.65,30.16 64.27,33.54 64.27,34.44 U4.47
USB_VBUS_B
  Top 0.254: U4.44 58.4,34.7 58.4,32.3 59.71,30.99 R7.P$1
USBHS_FAULT  (via drill 0.35)
  Top 0.254: U2.3 45.4,20.89 R12.P$1 v46.32,22.3 | v77.2,45.3 75.33,45.3 U4.78
  Bottom 0.254: v46.32,22.3 46.42,22.4 65.6,22.4 76.4,33.2 76.4,44.5 v77.2,45.3
USBHS_N
  Top 0.254: J3.D- 47.7,16.7 48.4,17.4 48.4,28.7 53.3,33.6 53.3,38.79 U4.31
USBHS_P
  Top 0.254: J3.D+ 49.7,16.7 48.9,17.5 48.9,28.52 53.71,33.33 53.71,38.49 U4.32
USBHS_VBUS  (via drill 0.35)
  Top 0.254: U2.5 47.35,17.86 45.2,15.71 | 45.2,15.71 45.2,16.2 C11.P$1 43.6,16.4 43.6,18.7 C15.1 | 45.2,15.71 J3.VBUS | v44.55,41.8 46.85,44.1 48.71,44.1 U4.17
  Top 0.508: v43.5,15 43.5,16.3 43.6,16.4
  Bottom 0.254: v43.5,15 43.5,39.37 44.55,40.66 v44.55,41.8
USBHS_VBUSEN
  Top 0.254: R1.P$1 47.4,22.8 47.4,20.89 U2.1
VCC  (via drill 0.35)
  Top 1.016: U5.P$2 14.95,63.9 23.4,63.9 25.52,66.02 v25.52,68.44
  Bottom 0.508: C22.P$1 25.1,80 24.6,79.5 | C24.P$1 25.4,78.9 25.3,78.8 | C21.P$1 25.4,77.7 25.3,77.8
  Bottom 1.016: v25.52,68.44 25.5,68.46 U$8.P+ 25.3,70.7 C23.1 25.3,77.8 25.3,78.8 24.6,79.5 21.31,79.5 | 21.31,79.5 IC4.1 | 21.31,79.5 11,79.5 9.11,77.61 IC3.1
VCL_F(FLASH)  (via drill 0.35)
  Top 0.254: U4.112 v70.03,62.59
  Bottom 0.254: C36.P$2 70.03,62.55 v70.03,62.59
VDD  (via drill 0.35)
  Top 0.254: 32.95,20.65 32.95,24.25 29.92,27.28 R26.P$2 R27.P$2 | U4.61 69.03,39.58 v69.03,39.27 | v75.53,57.45 75.5,57.45 U4.97 | U4.25 51.6,41.33 v51.6,40.9 | U4.26 51.88,40.9 v51.6,40.9 | U4.34 54.9,38.27 v54.9,37.9 54.9,28.6 57.3,26.2 R34.P$2 | U4.48 64.94,34.48 v64.94,34.06 64.94,34.01 C61.P$2 | v77.02,47.98 76.9,47.98 U4.84 | R18.P$2 73.51,36.21 73.08,35.78 v73.08,35.24 73.43,34.9 73.9,34.9 74.34,35.34 C59.P$1 | v51.6,40.9 51.6,40.8 C58.P$1 | U4.171 45.7,55.15 44.01,56.84 v43.75,56.84 | v66.2,67 66.2,66.53 65.05,65.38 U4.123 | v70.98,62.09 69.68,60.79 U4.110 | U4.154 50.29,62.56 v50.18,62.56 50.18,61.97 U4.155 | v48.6,62.5 49.6,61.5 49.6,60.42 U4.158 | U4.149 51.7,64.69 v51.44,64.69 | U4.138 56.4,67.77 v56.4,68.7 | U1.16 60.05,26.18 R34.P$2 | R34.P$2 60.07,27.38 C6.P$2 C65.P$1 R7.P$2
  Top 0.508: 32.95,20.65 v35.03,18.57 | R8.P$1 v10.5,59.2
  Top 1.016: v19.43,22.7 23.95,22.7 v24,22.65 24.04,22.69 30.91,22.69 v35.03,18.57 | v92.1,81.8 51.1,81.8 41.2,71.9 v41.2,71.8 23.8,71.8 20.8,68.8 v16.3,68.8 | J12.P$17 98.47,29.79 98.48,29.8 | 98.48,29.8 v98.48,71.2 | J12.P$1 98.45,9.47 98.48,9.5 98.48,29.8
  Bottom 0.254: U3.14 37.75,28.4 39.95,30.6 C49.P$1 | C14.P$2 66.2,66.9 v66.2,67 | U7.7 C63.P$1 14.17,26.16 C62.P$1 14.17,27.47 15.55,28.85 | U6.7 14.14,16.07 C19.P$1 C29.P$1 14.15,17.42 v19.43,22.7 | v56.4,68.7 57.05,68.05 57.05,68.02 | C54.P$2 58.93,70 59,70 | v43.75,56.84 45.2,56.84 C30.P$2 | C13.P$2 76.23,58.15 v75.53,57.45 72.18,54.1 72,54.1 71.8,54.1 | v77.02,47.98 76.64,48.37 C32.P$1 69.03,41.86 v69.03,39.27
  Bottom 0.305: v51.6,40.9 54.6,37.9 v54.9,37.9 54.98,37.82 C60.P$1 56.33,51.73 58.7,54.1 60.5,54.1 | C30.P$2 50.05,61.69 C55.P$2 | v66.2,67 64.1,64.9 60.5,64.9 | C10.P$2 71.58,62.69 v70.98,62.09 65.99,57.1 60.5,57.1 | C32.P$1 72,54.1
  Bottom 0.508: v24,22.65 23.92,22.73 FB2/2.1 | R29.P$2 R28.P$2 38.68,34.82 39.2,34.3 39.2,30.98 39.58,30.6 C49.P$1 41,30.6 C48.1 41.6,30 41.6,24.93 35.24,18.57 v35.03,18.57 35.03,9.9 33.37,8.24 | v64.94,34.06 64.94,35.16 v69.03,39.27 73.06,35.24 v73.08,35.24 | 60.5,54.1 71.8,54.1 | 52.53,63.34 C1.P$2 53.43,64.14 C56.P$2 | 33.37,8.24 19.67,8.24 R24.P$2 | C26.1 16.4,70.9 | C25.P$1 16.79,73.6 16.69,73.7 | R23.P$2 33.21,8.08 33.37,8.24 | v51.44,64.69 52.53,63.59 52.53,63.34 | 52.53,63.34 51.84,62.65 C2.P$2 51.76,62.51 51.76,62.43 C55.P$2 51.01,61.73 v50.18,62.56 48.66,62.56 v48.6,62.5 | 57.05,68.02 C54.P$2
  Bottom 0.61: J1.P$20 7.93,59.03 8.1,59.2
  Bottom 0.813: 98.44,71.16 v98.48,71.2 | C56.P$2 54.22,64.9 60.5,64.9
  Bottom 1.016: 60.5,54.1 60.5,57.1 60.5,64.9 60.5,68.5 59,70 57.2,71.8 54.68,71.8 v41.2,71.8 | v19.43,22.7 19.43,24.97 15.55,28.85 14.5,29.9 6.1,29.9 3.8,32.2 3.8,57.2 5.8,59.2 8.1,59.2 v10.5,59.2 16.3,65 v16.3,68.8 C26.1 | IC4.3 16.69,73.7 16.69,71.19 16.4,70.9 | U$2.P19 86.8,73.22 92.1,78.52 v92.1,81.8 95.94,77.96 J11.2 J11.4 98.44,71.16
VDD5  (via drill 0.35)
  Top 0.254: R1.P$2 45,23.5 44.2,22.7 R12.P$2 44.15,22.25 C5.P$1 C8.P$1 v40.8,22.25
  Top 0.508: U2.4 44.71,19.1 44.71,20.32 44.2,20.82 R12.P$2 | v2,59.3 4.1,59.3 R9.P$1
  Top 1.016: J12.P$2 J12.P$4
  Bottom 0.508: 4.4,71.2 C28.1 | C27.P$1 4.59,73.5 4.49,73.6
  Bottom 1.016: v40.8,22.25 35.94,17.39 35.94,6.5 33.48,4.04 33,4.04 | 33,4.04 10.56,4.04 2,12.6 v2,59.3 2,68.8 C28.1 | IC3.3 4.49,73.6 4.49,71.29 4.4,71.2 | J12.P$2 90.93,6.85 85.6,1.52 35.51,1.52 33,4.04
VDD_1.2
  Bottom 0.254: U3.1 30.32,26.4 C46.P$1 C45.P$1
VDD_ENET1
  Bottom 0.254: C44.P$1 27.79,26.41 | C44.P$1 27.79,26.59 28.09,26.9 U3.2 | C44.P$1 26.53,26.18 C43.1
  Bottom 0.508: C43.1 24.05,25.91 FB2/2.2
WARNOUT  (via drill 0.35)
  Top 0.254: U4.128 65.87,69.74 65.97,69.74 67.73,71.5 v67.9,71.5
  Bottom 0.254: U$2.P9 73.3,72.9 71.9,71.5 v67.9,71.5
XCIN
  Top 0.254: U4.20 47.55,40.82 C50.P$1 46.57,40.08 X3.P$1
XCOUT
  Top 0.254: U4.21 46.9,39.46 C51.P$1 46.17,39.19 X3.P$2
XII
  Bottom 0.254: U3.8 33.35,31.4 32.94,31.81 26.12,31.81 24.92,33.01 C42.P$1 24.92,32.71 24.66,32.45 22.11,32.45 U$3.1
XOO
  Bottom 0.254: U3.7 32.85,30.82 32.38,31.29 25.27,31.29 C41.P$1 24.87,31.58 24.55,31.9 19.95,31.9 19.65,31.61 U$3.3
XTAL1
  Top 0.254: X4.1 47.09,34.53 48.63,34.53 50,35.9 C52.P$1 49.96,37.32 49.96,38.28 49.5,38.74 49.5,40.65 U4.23 | U4.23
XTAL2
  Top 0.254: X4.3 51.19,35.38 C53.P$1 51.19,37.04 50.37,37.87 50.37,38.45 49.91,38.91 49.91,40.35 | U4.24 49.91,40.35 | 49.91,40.35
ZX0  (via drill 0.35)
  Top 0.254: U4.135 57.43,68.86 57.43,70.52 59.91,73 v59.91,75.89 v59.9,75.9
  Bottom 0.254: v59.9,75.9 63,75.9 U$2.P2
ZX1  (via drill 0.35)
  Top 0.254: v59.5,71.4 58.1,70 58.1,68.9 U4.134
  Bottom 0.254: v59.5,71.4 60.22,72.12 64.58,72.12 U$2.P3
ZX2  (via drill 0.35)
  Top 0.254: U4.133 58.64,69.06 58.64,69.54 60.85,71.75 60.85,74.25 v61,74.4
  Bottom 0.254: U$2.P4 65.68,75.73 64.37,74.42 61.02,74.42 v61,74.4

### Text on the board
tPlace: N | GND | N | L | L | L | N | L | N | ZX0 | ZX2 | CF2 | CF4 | IRQ0 | PM0 | DMA | SPI 0 / CS | SPI 0 / MISO | RST | VDD | GND | ZX1 | CF1 | CF3 | WARN | IRQ1 | PM1 | SCLK | SPI 0 / MOSI | VDD | VDD | GND | GND | GND | 5V | 3.3V | VDD | GND | P0_01 | P5_00 | P0_03 | P5_02 | P0_05 | P5_04 | P0_07 | P5_06 | P0_14 | P0_15 | P0_04 | P0_07 | P0_02 | P0_03 | P5_13 | P8_05 | P5_11 | P5_12 | TC TYPE K | YLW+ | RED- | YLW+ | RED-
tNames: 1 | 2 | TDI | TDO | TMS | TCK | RESET | 9 | 10 | GND | GND | GND | SPI 1 CS 0 | SPI 1 SCLK | SPI 1 MISO | GND | SPI 1 MOSI | GND | GND | GND | IIC 0 SCL | 5V | IIC 0 SDA | 5V | 3V